# EAGLE design working (EAGLE 5.11)
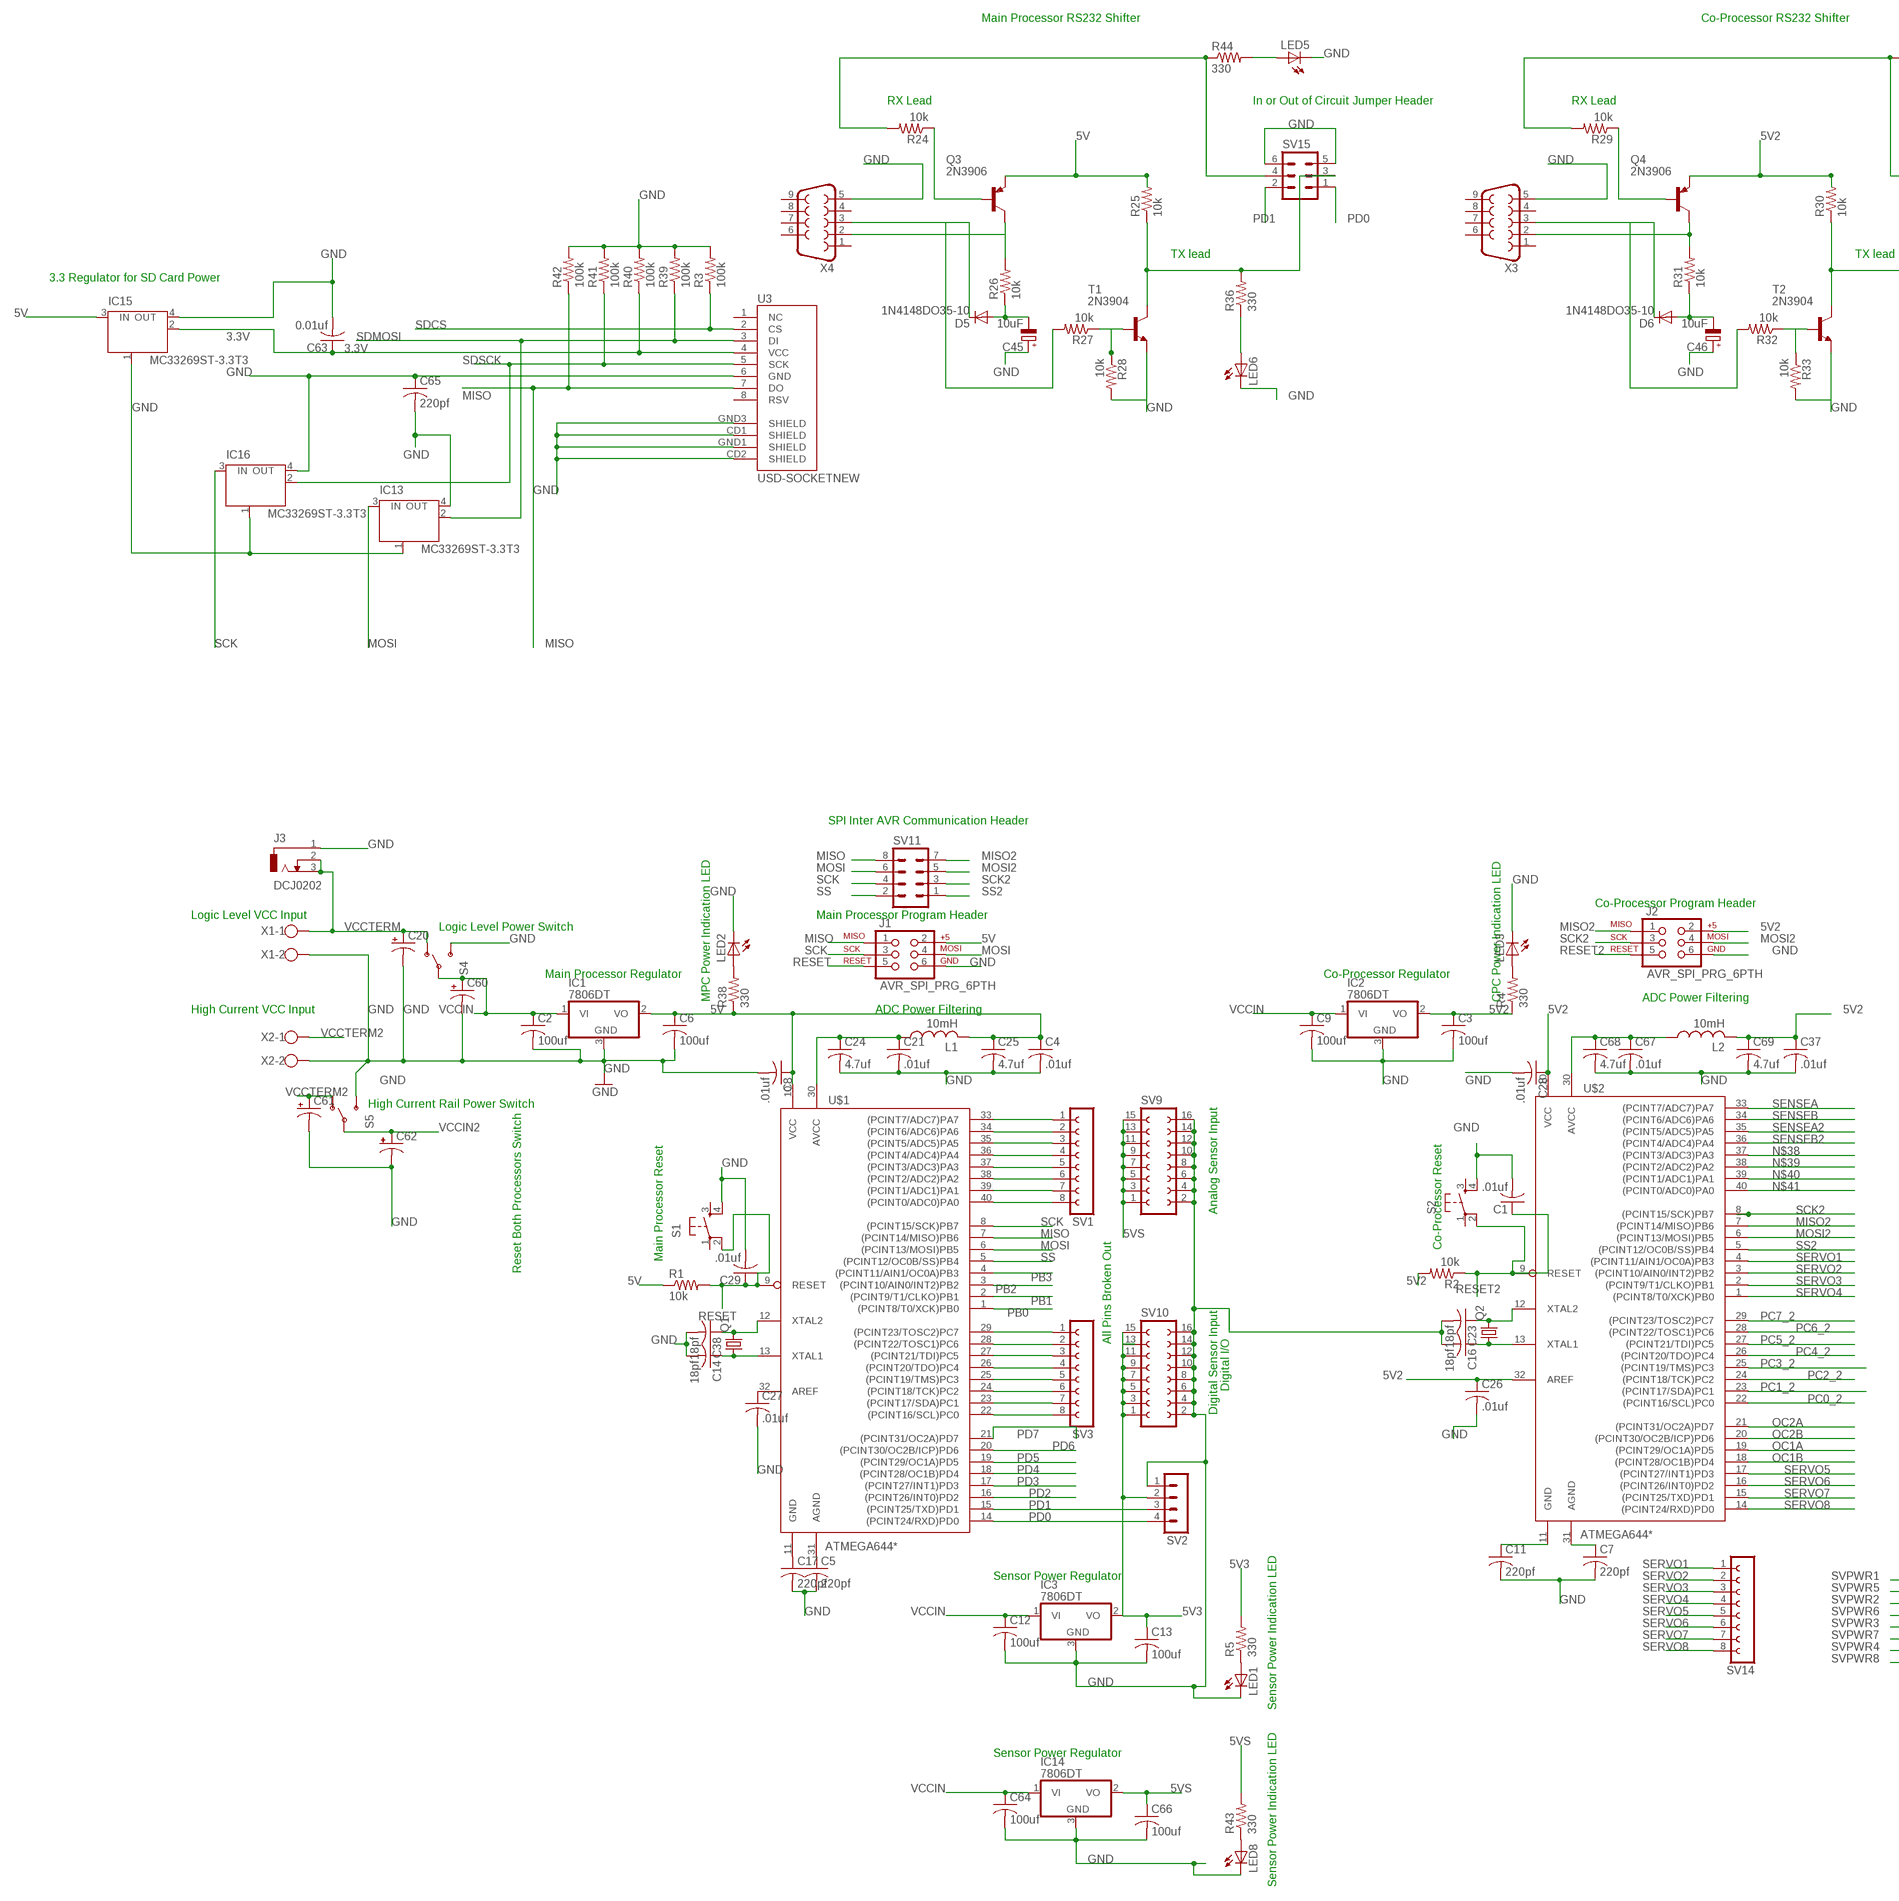
[diagram p0: schematic, sheet 1, part 1 of 2]
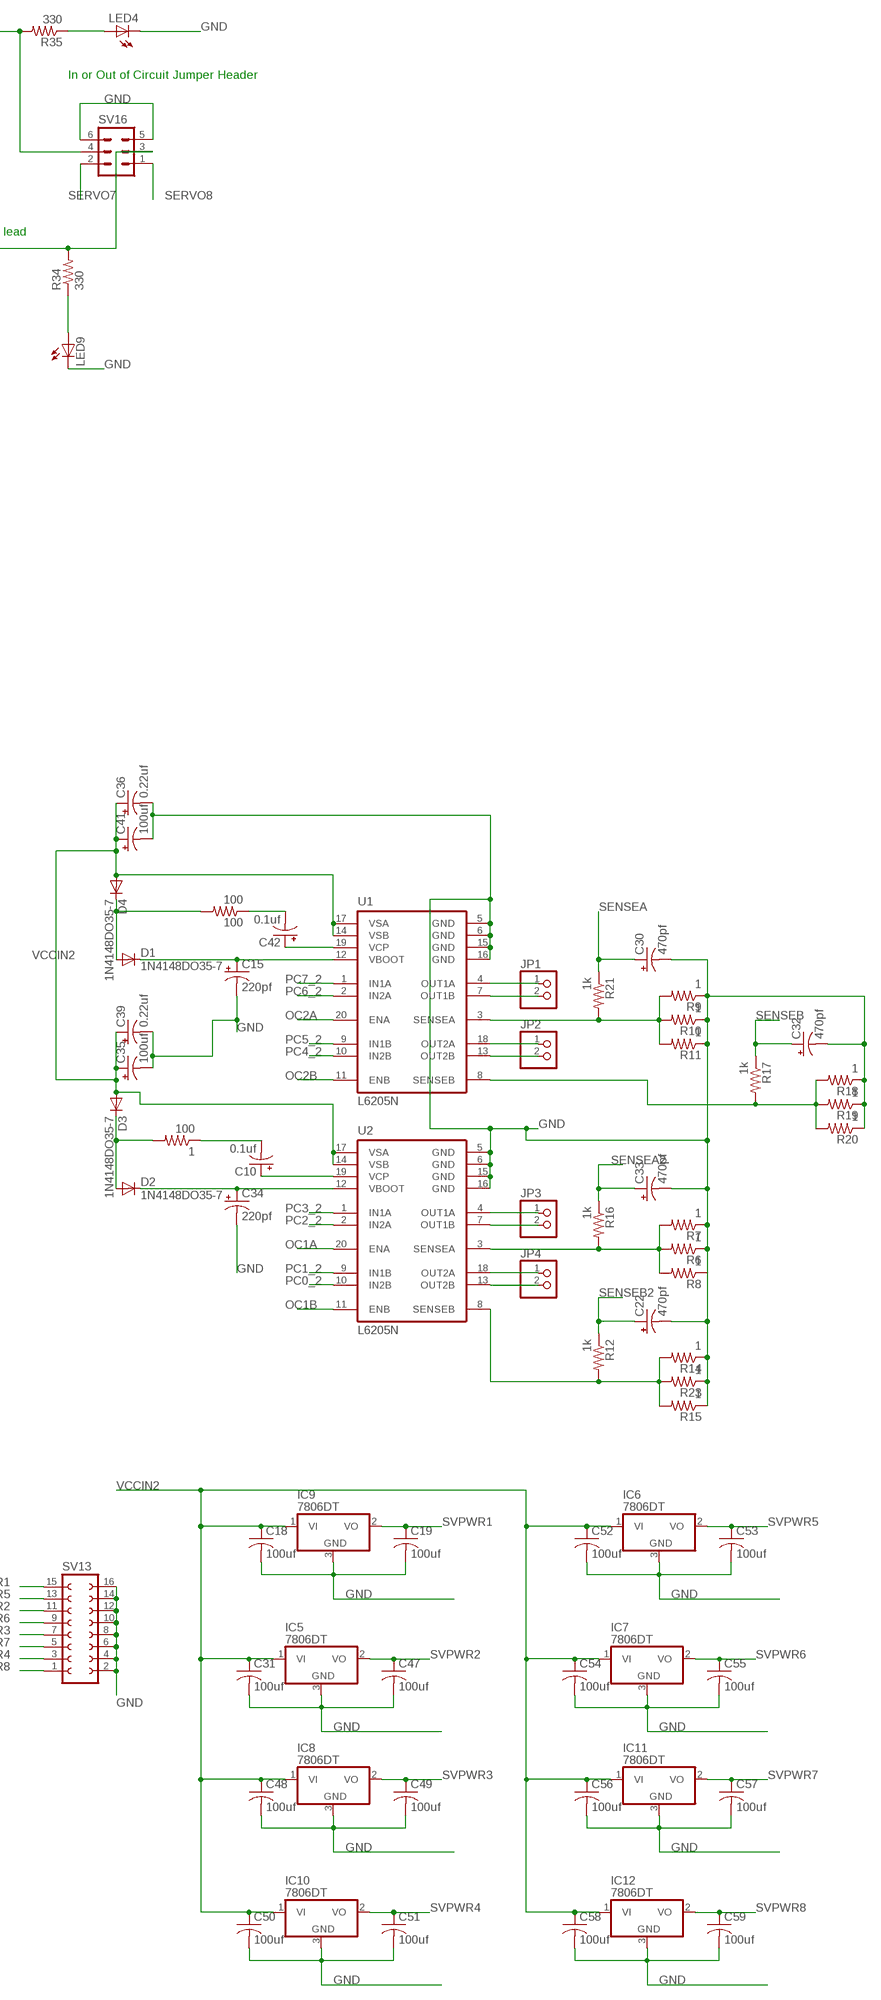
[diagram p1: schematic, sheet 1, part 2 of 2]

## Parts
1  100  R-US_0204/5  [0204/5]
100  100  R-US_0204/5  [0204/5]
C1  .01uf  C-USC1310  [C1310]
C2  100uf  C-USC1206K  [C1206K]
C3  100uf  C-USC1206K  [C1206K]
C4  .01uf  C-USC1310  [C1310]
C5  220pf  C-USC1206K  [C1206K]
C6  100uf  C-USC1206K  [C1206K]
C7  220pf  C-USC1206K  [C1206K]
C8  .01uf  C-USC1310  [C1310]
C9  100uf  C-USC1206K  [C1206K]
C10  0.1uf  CPOL-USE1.8-4  [E1,8-4]
C11  220pf  C-USC1206K  [C1206K]
C12  100uf  C-USC1206K  [C1206K]
C13  100uf  C-USC1206K  [C1206K]
C14  18pf  C-USC1206K  [C1206K]
C15  220pf  CPOL-USE1.8-4  [E1,8-4]
C16  18pf  C-USC1206K  [C1206K]
C17  220pf  C-USC1206K  [C1206K]
C18  100uf  C-USC1206K  [C1206K]
C19  100uf  C-USC1206K  [C1206K]
C20  CPOL-USE1.8-4  [E1,8-4]
C21  .01uf  C-USC1310  [C1310]
C22  470pf  CPOL-USE1.8-4  [E1,8-4]
C23  18pf  C-USC1206K  [C1206K]
C24  4.7uf  C-USC1310  [C1310]
C25  4.7uf  C-USC1310  [C1310]
C26  .01uf  C-USC1310  [C1310]
C27  .01uf  C-USC1310  [C1310]
C28  .01uf  C-USC1310  [C1310]
C29  .01uf  C-USC1310  [C1310]
C30  470pf  CPOL-USE1.8-4  [E1,8-4]
C31  100uf  C-USC1206K  [C1206K]
C32  470pf  CPOL-USE1.8-4  [E1,8-4]
C33  470pf  CPOL-USE1.8-4  [E1,8-4]
C34  220pf  CPOL-USE1.8-4  [E1,8-4]
C35  100uf  CPOL-USE1.8-4  [E1,8-4]
C36  0.22uf  CPOL-USE1.8-4  [E1,8-4]
C37  .01uf  C-USC1310  [C1310]
C38  18pf  C-USC1206K  [C1206K]
C39  0.22uf  CPOL-USE1.8-4  [E1,8-4]
C41  100uf  CPOL-USE1.8-4  [E1,8-4]
C42  0.1uf  CPOL-USE1.8-4  [E1,8-4]
C45  10uF  CPOL-EUE1.8-4  [E1,8-4]
C46  10uF  CPOL-EUE1.8-4  [E1,8-4]
C47  100uf  C-USC1206K  [C1206K]
C48  100uf  C-USC1206K  [C1206K]
C49  100uf  C-USC1206K  [C1206K]
C50  100uf  C-USC1206K  [C1206K]
C51  100uf  C-USC1206K  [C1206K]
C52  100uf  C-USC1206K  [C1206K]
C53  100uf  C-USC1206K  [C1206K]
C54  100uf  C-USC1206K  [C1206K]
C55  100uf  C-USC1206K  [C1206K]
C56  100uf  C-USC1206K  [C1206K]
C57  100uf  C-USC1206K  [C1206K]
C58  100uf  C-USC1206K  [C1206K]
C59  100uf  C-USC1206K  [C1206K]
C60  CPOL-USE1.8-4  [E1,8-4]
C61  CPOL-USE1.8-4  [E1,8-4]
C62  CPOL-USE1.8-4  [E1,8-4]
C63  0.01uf  C-USC1206K  [C1206K]
C64  100uf  C-USC1206K  [C1206K]
C65  220pf  C-USC1206K  [C1206K]
C66  100uf  C-USC1206K  [C1206K]
C67  .01uf  C-USC1310  [C1310]
C68  4.7uf  C-USC1310  [C1310]
C69  4.7uf  C-USC1310  [C1310]
D1  1N4148DO35-7  [DO35-7]
D2  1N4148DO35-7  [DO35-7]
D3  1N4148DO35-7  [DO35-7]
D4  1N4148DO35-7  [DO35-7]
D5  1N4148DO35-10  [DO35-10]
D6  1N4148DO35-10  [DO35-10]
IC1  7806DT  [TO252]
IC2  7806DT  [TO252]
IC3  7806DT  [TO252]
IC5  7806DT  [TO252]
IC6  7806DT  [TO252]
IC7  7806DT  [TO252]
IC8  7806DT  [TO252]
IC9  7806DT  [TO252]
IC10  7806DT  [TO252]
IC11  7806DT  [TO252]
IC12  7806DT  [TO252]
IC13  MC33269ST-3.3T3  [SOT223]
IC14  7806DT  [TO252]
IC15  MC33269ST-3.3T3  [SOT223]
IC16  MC33269ST-3.3T3  [SOT223]
J1  AVR_SPI_PRG_6PTH  [2X3]
J2  AVR_SPI_PRG_6PTH  [2X3]
J3  DCJ0202  [DCJ0202]
JP1  PINHD-1X2  [1X02]
JP2  PINHD-1X2  [1X02]
JP3  PINHD-1X2  [1X02]
JP4  PINHD-1X2  [1X02]
L1  10mH  L-USL3230M  [L3230M]
L2  10mH  L-USL3230M  [L3230M]
LED1  LED3MM  [LED3MM]
LED2  LED3MM  [LED3MM]
LED3  LED3MM  [LED3MM]
LED4  LED3MM  [LED3MM]
LED5  LED3MM  [LED3MM]
LED6  LED3MM  [LED3MM]
LED8  LED3MM  [LED3MM]
LED9  LED3MM  [LED3MM]
Q1  CRYSTALTC38H  [TC38H]
Q2  CRYSTALTC38H  [TC38H]
Q3  2N3906  [TO92]
Q4  2N3906  [TO92]
R1  10k  R-US_M1206  [M1206]
R2  10k  R-US_M1206  [M1206]
R3  100k  R-US_M1206  [M1206]
R4  330  R-US_M1206  [M1206]
R5  330  R-US_M1206  [M1206]
R6  1  R-US_0204/5  [0204/5]
R7  1  R-US_0204/5  [0204/5]
R8  1  R-US_0204/5  [0204/5]
R9  1  R-US_0204/5  [0204/5]
R10  1  R-US_0204/5  [0204/5]
R11  1  R-US_0204/5  [0204/5]
R12  1k  R-US_0204/5  [0204/5]
R14  1  R-US_0204/5  [0204/5]
R15  1  R-US_0204/5  [0204/5]
R16  1k  R-US_0204/5  [0204/5]
R17  1k  R-US_0204/5  [0204/5]
R18  1  R-US_0204/5  [0204/5]
R19  1  R-US_0204/5  [0204/5]
R20  1  R-US_0204/5  [0204/5]
R21  1k  R-US_0204/5  [0204/5]
R23  1  R-US_0204/5  [0204/5]
R24  10k  R-US_0204/5  [0204/5]
R25  10k  R-US_0204/5  [0204/5]
R26  10k  R-US_0204/5  [0204/5]
R27  10k  R-US_0204/5  [0204/5]
R28  10k  R-US_0204/5  [0204/5]
R29  10k  R-US_0204/5  [0204/5]
R30  10k  R-US_0204/5  [0204/5]
R31  10k  R-US_0204/5  [0204/5]
R32  10k  R-US_0204/5  [0204/5]
R33  10k  R-US_0204/5  [0204/5]
R34  330  R-US_0204/5  [0204/5]
R35  330  R-US_0204/5  [0204/5]
R36  330  R-US_0204/5  [0204/5]
R38  330  R-US_M1206  [M1206]
R39  100k  R-US_M1206  [M1206]
R40  100k  R-US_M1206  [M1206]
R41  100k  R-US_M1206  [M1206]
R42  100k  R-US_M1206  [M1206]
R43  330  R-US_M1206  [M1206]
R44  330  R-US_0204/5  [0204/5]
S1  TAC_SWITCHPTH  [TACTILE-PTH]
S2  TAC_SWITCHPTH  [TACTILE-PTH]
S4  SWITCH-SPSTPTH  [SWITCH-SPDT]
S5  SWITCH-SPSTPTH  [SWITCH-SPDT]
SV1  FE08-1  [FE08]
SV2  MA04-1  [MA04-1]
SV3  FE08-1  [FE08]
SV9  FE08-2  [FE08-2]
SV10  FE08-2  [FE08-2]
SV11  MA04-2  [MA04-2]
SV13  FE08-2  [FE08-2]
SV14  FE08-1  [FE08]
SV15  MA03-2  [MA03-2]
SV16  MA03-2  [MA03-2]
T1  2N3904  [TO92]
T2  2N3904  [TO92]
U1  L6205N  [DIL20]
U2  L6205N  [DIL20]
U3  USD-SOCKETNEW  [MICRO-SD-SOCKET-PP]
U$1  ATMEGA644*  [ATMEGA644]
U$2  ATMEGA644*  [ATMEGA644]
X1  W237-102  [W237-102]
X2  W237-102  [W237-102]
X3  DB9FEMALE  [DB9]
X4  DB9FEMALE  [DB9]

## Nets
3.3V: C63.1 IC15.2(OUT) R40.1 U3.4(VCC)
5V: C4.1 C6.1 C8.1 C25.1 C27.1 IC1.2(VO) IC15.3(IN) J1.2 L1.2 Q3.3(E) R1.1 R25.2 R38.1 U$1.10(VCC) U$1.32(AREF)
5V2: C3.1 C26.1 C28.1 C37.1 C69.1 IC2.2(VO) J2.2 L2.2 Q4.3(E) R2.2 R4.1 R30.2 U$2.10(VCC) U$2.32(AREF)
5V3: C13.1 IC3.2(VO) R5.2 SV2.2 SV10.1 SV10.3 SV10.5 SV10.7 SV10.9 SV10.11 SV10.13
5VS: C66.1 IC14.2(VO) R43.2 SV9.1 SV9.3 SV9.5 SV9.7 SV9.9 SV9.11 SV9.13 SV9.15
GND: C1.2 C2.2 C3.2 C4.2 C5.2 C6.2 C7.2 C8.2 C9.2 C11.2 C12.2 C13.2 C14.2 C15.- C16.2 C17.2 C18.2 C19.2 C20.- C21.2 C22.- C23.2 C24.2 C25.2 C26.2 C27.2 C28.2 C29.2 C30.- C31.2 C32.- C33.- C34.- C35.- C36.- C37.2 C38.2 C39.- C41.- C45.+ C46.+ C47.2 C48.2 C49.2 C50.2 C51.2 C52.2 C53.2 C54.2 C55.2 C56.2 C57.2 C58.2 C59.2 C60.- C61.- C62.- C63.2 C64.2 C65.1 C65.2 C66.2 C67.2 C68.2 C69.2 IC1.3(GND) IC2.3(GND) IC3.3(GND) IC5.3(GND) IC6.3(GND) IC7.3(GND) IC8.3(GND) IC9.3(GND) IC10.3(GND) IC11.3(GND) IC12.3(GND) IC13.1(GND/ADJ) IC13.4(OUT) IC14.3(GND) IC15.1(GND/ADJ) IC15.4(OUT) IC16.1(GND/ADJ) IC16.4(OUT) J1.6 J2.6 J3.1 LED1.K(C) LED2.K(C) LED3.K(C) LED4.K(C) LED5.K(C) LED6.K(C) LED8.K(C) LED9.K(C) R3.2 R6.1 R7.1 R8.1 R9.1 R10.1 R11.1 R14.1 R15.1 R18.1 R19.1 R20.1 R23.1 R28.2 R33.2 R39.2 R40.2 R41.2 R42.2 S1.4 S2.4 S4.3(S) S5.3(S) SV2.1 SV9.2 SV9.4 SV9.6 SV9.8 SV9.10 SV9.12 SV9.14 SV9.16 SV10.2 SV10.4 SV10.6 SV10.8 SV10.10 SV10.12 SV10.14 SV10.16 SV13.2 SV13.4 SV13.6 SV13.8 SV13.10 SV13.12 SV13.14 SV13.16 SV15.5 SV15.6 SV16.5 SV16.6 T1.3(E) T2.3(E) U1.5(GND) U1.6(GND) U1.15(GND) U1.16(GND) U2.5(GND) U2.6(GND) U2.15(GND) U2.16(GND) U3.6(GND) U3.CD1(SHIELD) U3.CD2(SHIELD) U3.GND1(SHIELD) U3.GND3(SHIELD) X1.2 X2.2 X3.5 X4.5
MISO: J1.1 R42.1 SV11.8 U3.7(DO) U$1.7((PCINT14/MISO)PB6)
MISO2: J2.1 SV11.7 U$2.7((PCINT14/MISO)PB6)
MOSI: IC13.3(IN) J1.4 SV11.6 U$1.6((PCINT13/MOSI)PB5)
MOSI2: J2.4 SV11.5 U$2.6((PCINT13/MOSI)PB5)
N$1: LED1.A R5.1
N$2: LED2.A R38.2
N$3: LED3.A R4.2
N$4: C21.1 C24.1 L1.1 U$1.30(AVCC)
N$5: C5.1 U$1.31(AGND)
N$6: JP1.1 U1.4(OUT1A)
N$7: SV1.1 U$1.33((PCINT7/ADC7)PA7)
N$8: SV1.2 U$1.34((PCINT6/ADC6)PA6)
N$9: SV1.3 U$1.35((PCINT5/ADC5)PA5)
N$10: SV1.4 U$1.36((PCINT4/ADC4)PA4)
N$11: SV1.5 U$1.37((PCINT3/ADC3)PA3)
N$12: SV1.6 U$1.38((PCINT2/ADC2)PA2)
N$13: SV1.7 U$1.39((PCINT1/ADC1)PA1)
N$14: SV1.8 U$1.40((PCINT0/ADC0)PA0)
N$15: SV3.1 U$1.29((PCINT23/TOSC2)PC7)
N$16: SV3.2 U$1.28((PCINT22/TOSC1)PC6)
N$17: SV3.3 U$1.27((PCINT21/TDI)PC5)
N$18: SV3.4 U$1.26((PCINT20/TDO)PC4)
N$19: SV3.5 U$1.25((PCINT19/TMS)PC3)
N$20: SV3.6 U$1.24((PCINT18/TCK)PC2)
N$21: SV3.7 U$1.23((PCINT17/SDA)PC1)
N$22: SV3.8 U$1.22((PCINT16/SCL)PC0)
N$23: JP1.2 U1.7(OUT1B)
N$24: JP2.1 U1.18(OUT2A)
N$25: JP2.2 U1.13(OUT2B)
N$26: JP3.1 U2.4(OUT1A)
N$27: JP3.2 U2.7(OUT1B)
N$28: JP4.1 U2.18(OUT2A)
N$29: JP4.2 U2.13(OUT2B)
N$30: C15.+ D1.C U1.12(VBOOT)
N$31: C34.+ D2.C U2.12(VBOOT)
N$32: R6.2 R7.2 R8.2 R16.2 U2.3(SENSEA)
N$33: C14.1 Q1.1 U$1.13(XTAL1)
N$34: C38.1 Q1.2 U$1.12(XTAL2)
N$35: C16.1 Q2.1 U$2.13(XTAL1)
N$36: C23.1 Q2.2 U$2.12(XTAL2)
N$37: C42.+ U1.19(VCP)
N$38: U$2.37((PCINT3/ADC3)PA3)
N$39: U$2.38((PCINT2/ADC2)PA2)
N$40: U$2.39((PCINT1/ADC1)PA1)
N$41: U$2.40((PCINT0/ADC0)PA0)
N$42: R9.2 R10.2 R11.2 R21.2 U1.3(SENSEA)
N$43: C10.+ U2.19(VCP)
N$44: R12.2 R14.2 R15.2 R23.2 U2.8(SENSEB)
N$45: 100.1 C42.-
N$46: R17.2 R18.2 R19.2 R20.2 U1.8(SENSEB)
N$47: 1.1 C10.-
N$48: 1.2 D2.A D3.C
N$49: 100.2 D1.A D4.C
N$50: Q4.1(C) R31.2 X3.2
N$51: Q4.2(B) R29.1
N$52: Q3.1(C) R26.2 X4.2
N$53: Q3.2(B) R24.1
N$54: R25.1 R36.2 SV15.3 T1.1(C)
N$55: R27.1 R28.1 T1.2(B)
N$56: D5.C R27.2 X4.3
N$57: C45.- D5.A R26.1
N$58: R30.1 R34.2 SV16.3 T2.1(C)
N$59: R32.1 R33.1 T2.2(B)
N$60: D6.C R32.2 X3.3
N$61: C46.- D6.A R31.1
N$62: R29.2 R35.2 SV16.4
N$63: LED9.A R34.1
N$64: LED4.A R35.1
N$65: LED5.A R44.2
N$66: LED6.A R36.1
N$67: C11.1 U$2.11(GND)
N$68: C17.1 U$1.11(GND)
N$69: LED8.A R43.1
N$70: SV10.15
N$71: C67.1 C68.1 L2.1 U$2.30(AVCC)
N$72: C7.1 U$2.31(AGND)
N$74: R24.2 R44.1 SV15.4
OC1A: U2.20(ENA) U$2.19((PCINT29/OC1A)PD5)
OC1B: U2.11(ENB) U$2.18((PCINT28/OC1B)PD4)
OC2A: U1.20(ENA) U$2.21((PCINT31/OC2A)PD7)
OC2B: U1.11(ENB) U$2.20((PCINT30/OC2B/ICP)PD6)
PB0: U$1.1((PCINT8/T0/XCK)PB0)
PB1: U$1.2((PCINT9/T1/CLKO)PB1)
PB2: U$1.3((PCINT10/AIN0/INT2)PB2)
PB3: U$1.4((PCINT11/AIN1/OC0A)PB3)
PC0_2: U2.10(IN2B) U$2.22((PCINT16/SCL)PC0)
PC1_2: U2.9(IN1B) U$2.23((PCINT17/SDA)PC1)
PC2_2: U2.2(IN2A) U$2.24((PCINT18/TCK)PC2)
PC3_2: U2.1(IN1A) U$2.25((PCINT19/TMS)PC3)
PC4_2: U1.10(IN2B) U$2.26((PCINT20/TDO)PC4)
PC5_2: U1.9(IN1B) U$2.27((PCINT21/TDI)PC5)
PC6_2: U1.2(IN2A) U$2.28((PCINT22/TOSC1)PC6)
PC7_2: U1.1(IN1A) U$2.29((PCINT23/TOSC2)PC7)
PD0: SV2.4 SV15.1 U$1.14((PCINT24/RXD)PD0)
PD1: SV2.3 SV15.2 U$1.15((PCINT25/TXD)PD1)
PD2: U$1.16((PCINT26/INT0)PD2)
PD3: U$1.17((PCINT27/INT1)PD3)
PD4: U$1.18((PCINT28/OC1B)PD4)
PD5: U$1.19((PCINT29/OC1A)PD5)
PD6: U$1.20((PCINT30/OC2B/ICP)PD6)
PD7: U$1.21((PCINT31/OC2A)PD7)
RESET: C29.1 J1.5 R1.2 S1.2 U$1.9(RESET)
RESET2: C1.1 J2.5 R2.1 S2.2 U$2.9(RESET)
SCK: IC16.3(IN) J1.3 SV11.4 U$1.8((PCINT15/SCK)PB7)
SCK2: J2.3 SV11.3 U$2.8((PCINT15/SCK)PB7)
SDCS: R3.1 U3.2(CS)
SDMOSI: IC13.2(OUT) R39.1 U3.3(DI)
SDSCK: IC16.2(OUT) R41.1 U3.5(SCK)
SENSEA: C30.+ R21.1 U$2.33((PCINT7/ADC7)PA7)
SENSEA2: C33.+ R16.1 U$2.35((PCINT5/ADC5)PA5)
SENSEB: C32.+ R17.1 U$2.34((PCINT6/ADC6)PA6)
SENSEB2: C22.+ R12.1 U$2.36((PCINT4/ADC4)PA4)
SERVO1: SV14.1 U$2.4((PCINT11/AIN1/OC0A)PB3)
SERVO2: SV14.2 U$2.3((PCINT10/AIN0/INT2)PB2)
SERVO3: SV14.3 U$2.2((PCINT9/T1/CLKO)PB1)
SERVO4: SV14.4 U$2.1((PCINT8/T0/XCK)PB0)
SERVO5: SV14.5 U$2.17((PCINT27/INT1)PD3)
SERVO6: SV14.6 U$2.16((PCINT26/INT0)PD2)
SERVO7: SV14.7 SV16.2 U$2.15((PCINT25/TXD)PD1)
SERVO8: SV14.8 SV16.1 U$2.14((PCINT24/RXD)PD0)
SS: SV11.2 U$1.5((PCINT12/OC0B/SS)PB4)
SS2: SV11.1 U$2.5((PCINT12/OC0B/SS)PB4)
SVPWR1: C19.1 IC9.2(VO) SV13.15
SVPWR2: C47.1 IC5.2(VO) SV13.11
SVPWR3: C49.1 IC8.2(VO) SV13.7
SVPWR4: C51.1 IC10.2(VO) SV13.3
SVPWR5: C53.1 IC6.2(VO) SV13.13
SVPWR6: C55.1 IC7.2(VO) SV13.9
SVPWR7: C57.1 IC11.2(VO) SV13.5
SVPWR8: C59.1 IC12.2(VO) SV13.1
VCCIN: C2.1 C9.1 C12.1 C60.+ C64.1 IC1.1(VI) IC2.1(VI) IC3.1(VI) IC14.1(VI) S4.2(P)
VCCIN2: C18.1 C31.1 C35.+ C36.+ C39.+ C41.+ C48.1 C50.1 C52.1 C54.1 C56.1 C58.1 C62.+ D3.A D4.A IC5.1(VI) IC6.1(VI) IC7.1(VI) IC8.1(VI) IC9.1(VI) IC10.1(VI) IC11.1(VI) IC12.1(VI) S5.2(P) U1.14(VSB) U1.17(VSA) U2.14(VSB) U2.17(VSA)
VCCTERM: C20.+ J3.2 J3.3 S4.1(O) X1.1
VCCTERM2: C61.+ S5.1(O) X2.1
Unconnected: S1.1 S1.3 S2.1 S2.3 U3.1(NC) U3.8(RSV) X3.1 X3.4 X3.6 X3.7 X3.8 X3.9 X4.1 X4.4 X4.6 X4.7 X4.8 X4.9

## Notes on the sheet
- Main Processor RS232 Shifter | Co-Processor RS232 Shifter
- RX Lead | In or Out of Circuit Jumper Header | RX Lead | In or Out of Circuit Jumper Header
- TX lead | TX lead
- 3.3 Regulator for SD Card Power
- SPI Inter AVR Communication Header
- Co-Processor Program Header
- Logic Level VCC Input | Main Processor Program Header
- Logic Level Power Switch
- Main Processor Regulator | Co-Processor Regulator
- MPC Power Indication LED | CPC Power Indication LED | ADC Power Filtering
- High Current VCC Input | ADC Power Filtering
- High Current Rail Power Switch
- Analog Sensor Input
- Co-Processor Reset
- Main Processor Reset
- Reset Both Processors Switch
- All Pins Broken Out
- Digital I/O
- Digital Sensor Input
- Sensor Power Regulator
- Sensor Power Indication LED
- Sensor Power Regulator
- Sensor Power Indication LED

## Library data of the parts
1 100 R1 R2 R6-R12 R14-R21 R23-R36 R44 = resistor:R-US_: RESISTOR, American symbol
C1 C4 C8 C21 C24-C29 C37 C67-C69 = rcl:C-US: CAPACITOR, American symbol
C2 C3 C5-C7 C9 C11-C14 C16-C19 C23 C31 C38 C47-C59 C63-C66 = resistor:C-US: CAPACITOR, American symbol
C10 C15 C20 C22 C30 C32-C36 C39 C41 C42 C60-C62 = rcl:CPOL-US: POLARIZED CAPACITOR, American symbol
C45 C46 = rcl:CPOL-EU: POLARIZED CAPACITOR, European symbol
D1-D6 = diode:1N4148: DIODE high speed (Philips)
IC1-IC3 IC5-IC12 IC14 = linear:78*: Positive VOLTAGE REGULATOR Source: http://cache.national.com/ds/LM/LM78L05.pdf http://www.fairchildsemi.com/ds/LM/LM7805.pdf
IC13 IC15 IC16 = linear:MC33269ST*: Adjustable Output Low Dropout Voltage Regulator 800 mA Source: http://www.onsemi.com/pub/Collateral/MC33269-D.PDF
J1 J2 = SparkFun:AVR_SPI_PRG_6: AVR ISP 6 Pin This is the reduced ISP connector for AVR programming. Common on Arduino. This footprint will take up less PCB space and can be used with a 10-pin to 6-pin adapter such as SKU: BOB-08508
J3 = con-jack:DCJ0202: DC POWER JACK Source: DCJ0202.pdf; OC_FARNELL: unknown; OC_NEWARK: unknown
JP1-JP4 = pinhead:PINHD-1X2: PIN HEADER
L1 L2 = rcl:L-US: INDUCTOR, American symbol
LED1-LED6 LED8 LED9 = led:LED: LED OSRAM: - CHIPLED LG R971, LG N971, LY N971, LG Q971, LY Q971, LO R971, LY R971 LH N974, LH R974 LS Q976, LO Q976, LY Q976 LO Q996 - Hyper CHIPLED LW Q18S LB Q993, LB Q99A, LB R99A - SideLED LS A670, LO A670, LY A670, LG A670, LP A670 LB A673, LV A673, LT A673, LW A673 LH A674 LY A675 LS A676, LA A676, LO A676, LY A676, LW A676 LS A679, LY A679, LG A679 - Hyper Micro SIDELED® LS Y876, LA Y876, LO Y876, LY Y876 LT Y87S - SmartLED LW L88C, LW L88S LB L89C, LB L89S, LG L890 LS L89K, LO L89K, LY L89K LS L896, LA L896, LO L896, LY L896 - TOPLED LS T670, LO T670, LY T670, LG T670, LP T670 LSG T670, LSP T670, LSY T670, LOP T670, LYG T670 LG T671, LOG T671, LSG T671 LB T673, LV T673, LT T673, LW T673 LH T674 LS T676, LA T676, LO T676, LY T676, LB T676, LH T676, LSB T676, LW T676 LB T67C, LV T67C, LT T67C, LS T67K, LO T67K, LY T67K, LW E67C LS E67B, LA E67B, LO E67B, LY E67B, LB E67C, LV E67C, LT E67C LW T67C LS T679, LY T679, LG T679 LS T770, LO T770, LY T770, LG T770, LP T770 LB T773, LV T773, LT T773, LW T773 LH T774 LS E675, LA E675, LY E675, LS T675 LS T776, LA T776, LO T776, LY T776, LB T776 LHGB T686 LT T68C, LB T68C - Hyper Mini TOPLED® LB M676 - Mini TOPLED Santana® LG M470 LS M47K, LO M47K, LY M47K Source: http://www.osram.convergy.de LUXEON: - LUMILED® LXK2-PW12-R00, LXK2-PW12-S00, LXK2-PW14-U00, LXK2-PW14-V00 LXK2-PM12-R00, LXK2-PM12-S00, LXK2-PM14-U00 LXK2-PE12-Q00, LXK2-PE12-R00, LXK2-PE12-S00, LXK2-PE14-T00, LXK2-PE14-U00 LXK2-PB12-K00, LXK2-PB12-L00, LXK2-PB12-M00, LXK2-PB14-N00, LXK2-PB14-P00, LXK2-PB14-Q00 LXK2-PR12-L00, LXK2-PR12-M00, LXK2-PR14-Q00, LXK2-PR14-R00 LXK2-PD12-Q00, LXK2-PD12-R00, LXK2-PD12-S00 LXK2-PH12-R00, LXK2-PH12-S00 LXK2-PL12-P00, LXK2-PL12-Q00, LXK2-PL12-R00 Source: www.luxeon.com KINGBRIGHT: KA-3528ASYC Source: www.kingbright.com
Q1 Q2 = crystal:CRYSTAL: CRYSTAL; OC_FARNELL: unknown; OC_NEWARK: unknown
Q3 Q4 = transistor-pnp:2N3906: PNP Transistor
R3-R5 R38-R43 = rcl:R-US_: RESISTOR, American symbol
S1 S2 = SparkFun:TAC_SWITCH: Momentary Switch Button commonly used for reset or general input. Spark Fun Electronics SKU : COM-00097
S4 S5 = SparkFun:SWITCH-SPST: SPST Switch Simple slide switch. Spark Fun Electronics SKU : COM-00102
SV1 SV3 SV14 = con-lsta:FE08-1: FEMALE HEADER; OC_FARNELL: unknown; OC_NEWARK: unknown
SV2 = con-lstb:MA04-1: PIN HEADER; OC_FARNELL: unknown; OC_NEWARK: unknown
SV9 SV10 SV13 = con-lsta:FE08-2: FEMALE HEADER; OC_FARNELL: unknown; OC_NEWARK: unknown
SV11 = con-lstb:MA04-2: PIN HEADER; OC_FARNELL: unknown; OC_NEWARK: unknown
SV15 SV16 = con-lstb:MA03-2: PIN HEADER; OC_FARNELL: unknown; OC_NEWARK: unknown
T1 T2 = transistor:2N3904: NPN TRANSISTOR
U1 U2 = L6205:L6205*: L6205* DMOS DUAL FULL BRIDGE DRIVER Cases: L6205N (PowerDIP20), L6205D (PowerSO20) Author: Dipl.-Ing. FH Rainer Bayer, rainer.bayer@hs-heilbronn.de, www.ing-rb.de/hhn Notes: 1. ENA, ENB pin direction "I/O": see data sheet (ENA and ENB pins open collector driving vs. push-pull driving) 2. SENSEA, SENSEB pin direction "PWR": see data sheet (power ground)
U3 = SparkFun:USD-SOCKET: microSD Socket Push-push type uSD socket. Schematic element and footprint production proven. Spark Fun Electronics SKU : PRT-00127. tDoc lines correctly indicate media card edge positions when inserting (unlocked, locked, depressed).
U$1 U$2 = ATMega644:ATMEGA644
X1 X2 = con-wago-500:W237-102: WAGO SCREW CLAMP; MPN: 237-102; OC_FARNELL: unknown; OC_NEWARK: 70K9898
X3 X4 = SparkFun:DB9: DB9 Connector Standard DB9 (D-Sub 9) serial connector. Can be used for CAN bus as well as RS485 and RS232. Footprint production proven. Spark Fun Electronics SKU : PRT-00429

## Board
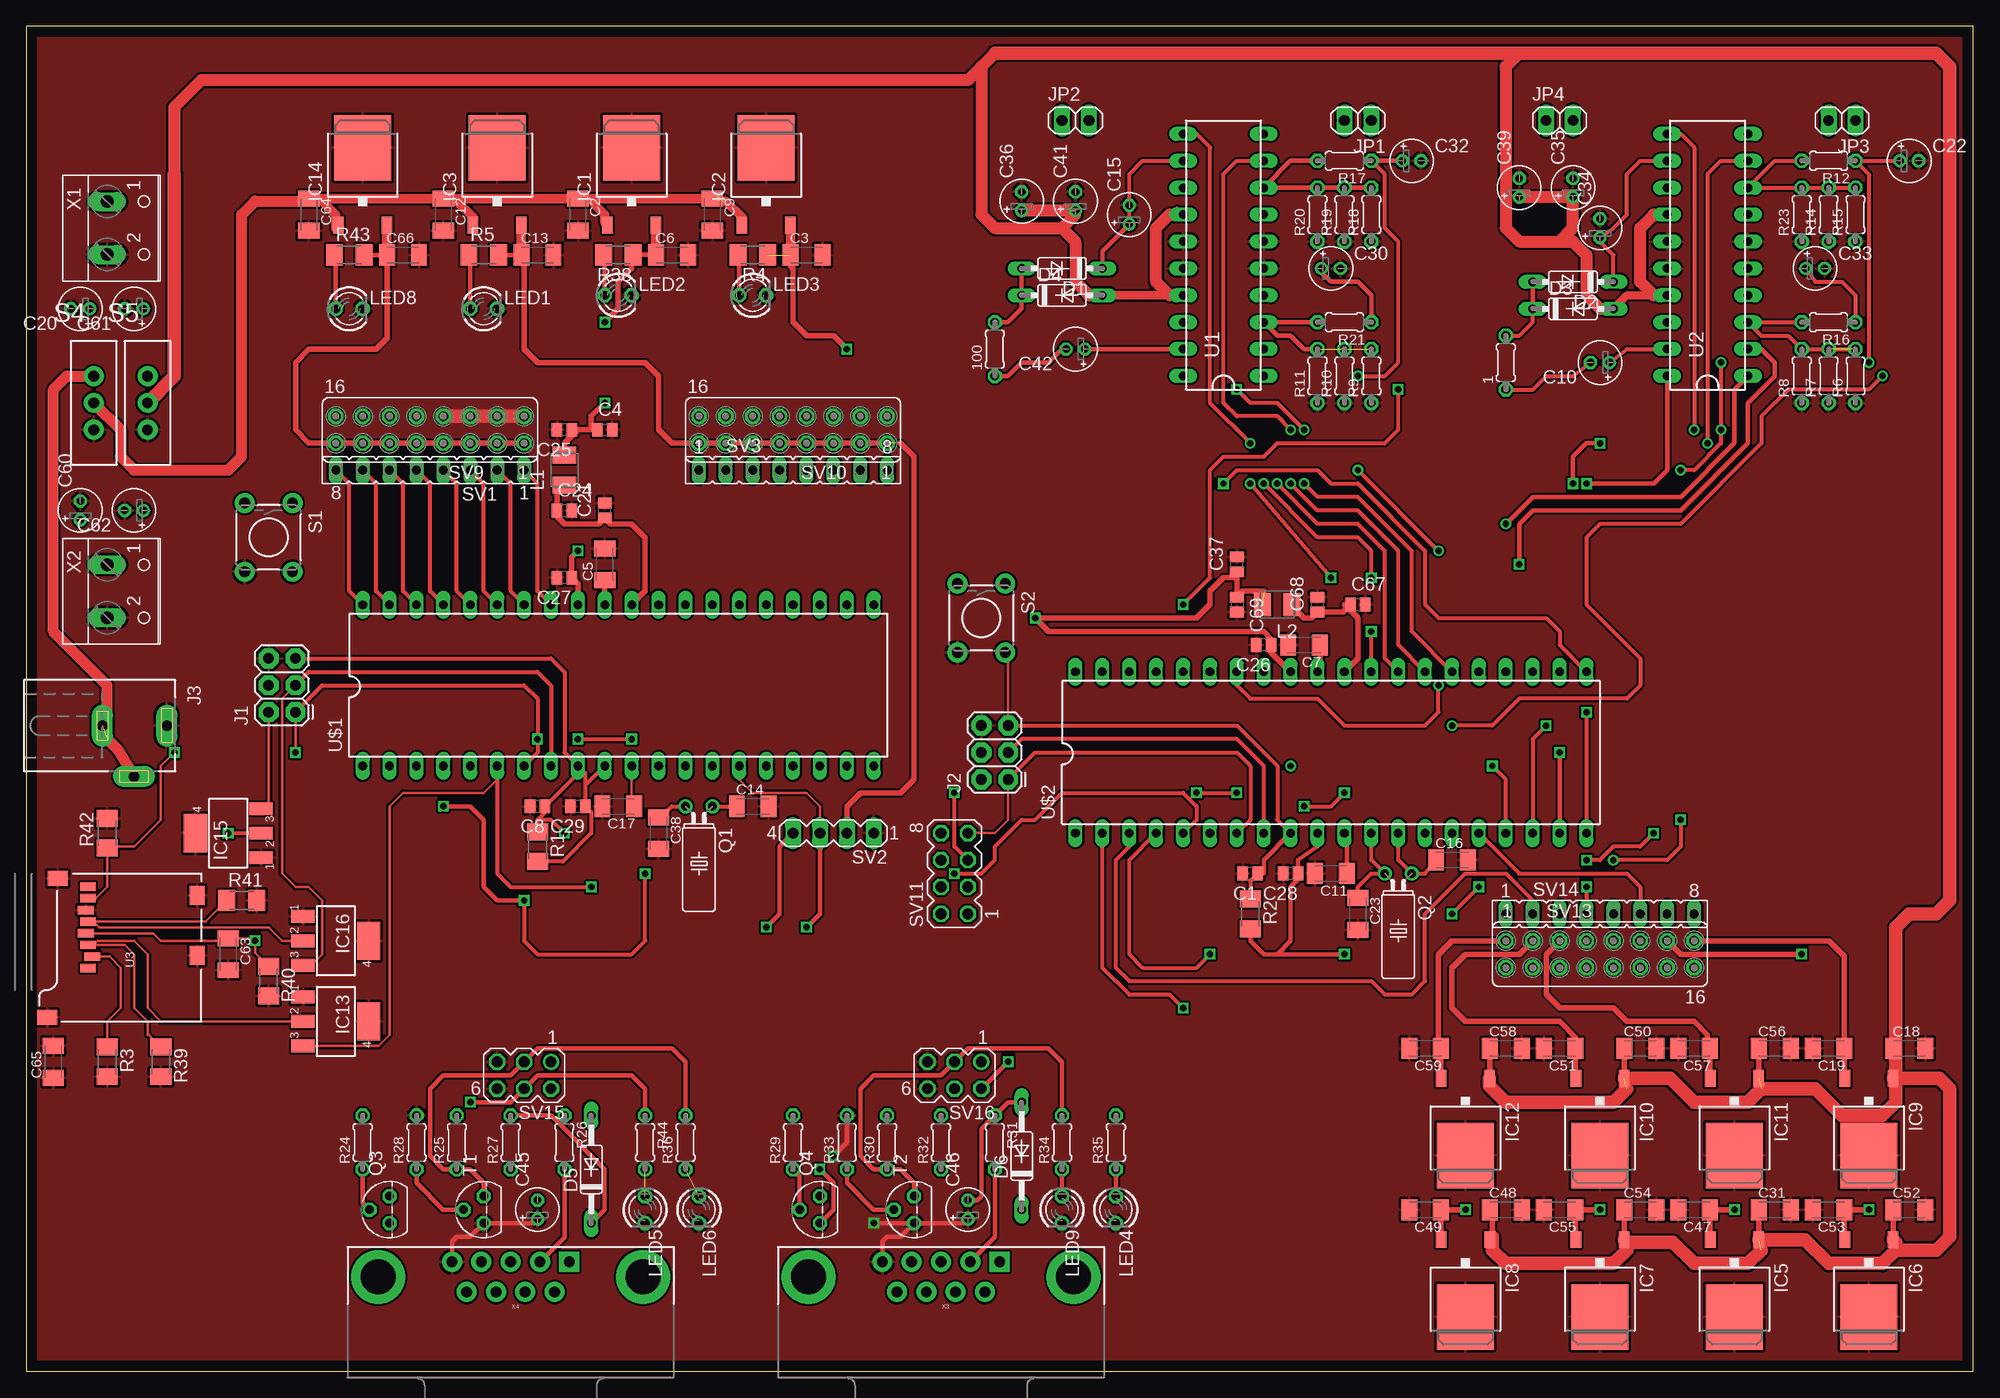
[diagram p2: board, top side]
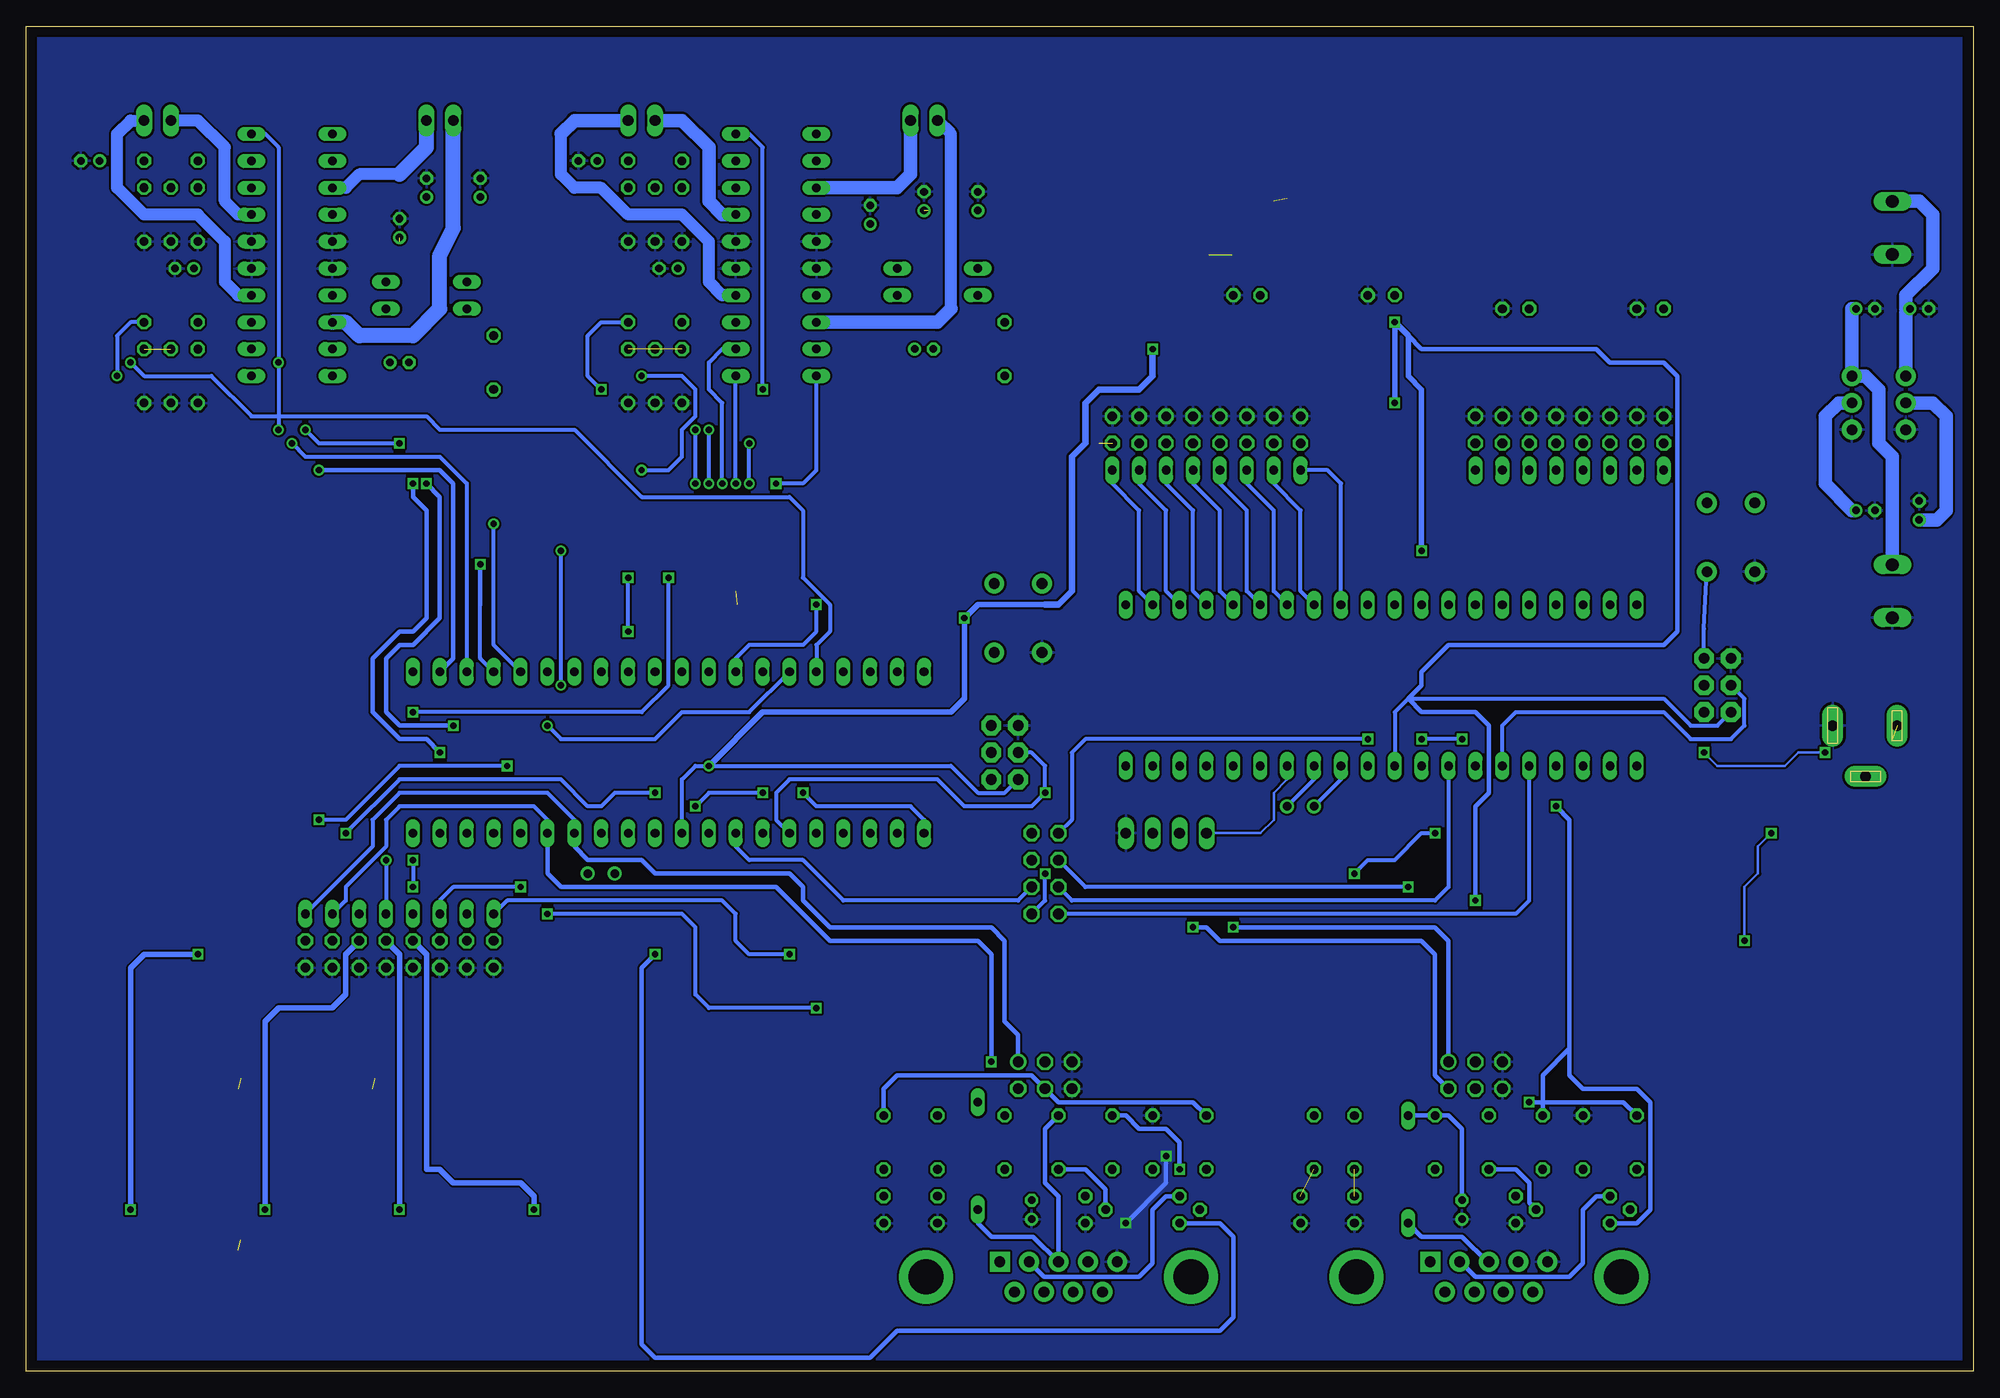
[diagram p3: board, bottom side, seen from below]

Size 183.82 x 126.99 mm. Coordinates in mm from the lower left corner, seen from the top.
Outline: 0,0 183.82,0 183.82,126.99 0,126.99 0,0
Copper layers (1*16): Top 0.035mm / dielectric 1.5mm / Bottom 0.035mm
Design rules "default": minimum track width 10mil, minimum drill 24mil, track to track 8mil, track to pad 8mil, pad to pad 8mil, via to via 8mil, smd to smd 8mil, copper to edge 40mil, drill to drill 8mil, minimum pad ring 10mil, minimum via ring 8mil, stop-mask expansion 4mil, vias tented up to drill 0mil, thermal gap 10mil

### Footprints (pad centres in the part's own frame; a part is rotated, then mirrored left to right if it is on the bottom)
0204/5 = drill 0.813 octagon: 1 -2.54,0; 2 2.54,0
C1310 = smd 1 x 1.3: 1 -0.7,0; 2 0.7,0
C1206K = smd 1.5 x 2: 1 -1.5,0; 2 1.5,0
E1,8-4 = drill 0.711 pad 1.168 round: + -0.889,0 | drill 0.711 pad 1.168 octagon: - 0.889,0
DO35-7 = drill 0.813 long: A 3.81,0; C -3.81,0
DO35-10 = drill 0.813 long: A 5.08,0; C -5.08,0
TO252 = smd 1 x 1.6: 1 -2.28,-4.8; 2 2.28,-4.8 | smd 5.4 x 6.2: 3 0,2.5
SOT223 = smd 1.219 x 2.235: 1 -2.311,-3.099; 2 0,-3.099; 3 2.311,-3.099 | smd 3.6 x 2.2: 4 0,3.099
2X3 = drill 1.016 pad 1.88 octagon: 1 0,0; 2 0,2.54; 3 2.54,0; 4 2.54,2.54; 5 5.08,0; 6 5.08,2.54
DCJ0202 = drill 1 pad 2 long: 1 0,3.1; 2 4.8,0; 3 0,-3
1X02 = drill 1.016 long: 1 -1.27,0; 2 1.27,0
L3230M = smd 1.6 x 2.2: 1 -1.4,0; 2 1.4,0
LED3MM = drill 0.813 octagon: A -1.27,0; K 1.27,0
TC38H = drill 0.813 round: 1 -1.27,0; 2 1.27,0
TO92 = drill 0.813 octagon: 1 1.27,0; 2 0,1.905; 3 -1.27,0
M1206 = smd 1.6 x 2: 1 -1.4,0; 2 1.4,0
TACTILE-PTH = drill 1.016 pad 1.88 round: 1 -3.251,2.261; 2 3.251,2.261; 3 -3.251,-2.261; 4 3.251,-2.261
SWITCH-SPDT = drill 1.016 pad 1.88 round: 1 0,2.54; 2 0,0; 3 0,-2.54
FE08 = drill 0.813 long: 1 -8.89,0; 2 -6.35,0; 3 -3.81,0; 4 -1.27,0; 5 1.27,0; 6 3.81,0; 7 6.35,0; 8 8.89,0
MA04-1 = drill 1.016 long: 1 -3.81,0; 2 -1.27,0; 3 1.27,0; 4 3.81,0
FE08-2 = drill 0.914 octagon: 1 -8.89,1.27; 2 -8.89,-1.27; 3 -6.35,1.27; 4 -6.35,-1.27; 5 -3.81,1.27; 6 -3.81,-1.27; 7 -1.27,1.27; 8 -1.27,-1.27; 9 1.27,1.27; 10 1.27,-1.27; 11 3.81,1.27; 12 3.81,-1.27; 13 6.35,1.27; 14 6.35,-1.27; 15 8.89,1.27; 16 8.89,-1.27
MA04-2 = drill 1.016 octagon: 1 -3.81,-1.27; 2 -3.81,1.27; 3 -1.27,-1.27; 4 -1.27,1.27; 5 1.27,-1.27; 6 1.27,1.27; 7 3.81,-1.27; 8 3.81,1.27
MA03-2 = drill 1.016 round: 1 -2.54,-1.27 | drill 1.016 octagon: 2 -2.54,1.27; 3 0,-1.27; 4 0,1.27; 5 2.54,-1.27; 6 2.54,1.27
DIL20 = drill 0.8 long: 1 -11.43,-3.81; 2 -8.89,-3.81; 3 -6.35,-3.81; 4 -3.81,-3.81; 5 -1.27,-3.81; 6 1.27,-3.81; 7 3.81,-3.81; 8 6.35,-3.81; 9 8.89,-3.81; 10 11.43,-3.81; 11 11.43,3.81; 12 8.89,3.81; 13 6.35,3.81; 14 3.81,3.81; 15 1.27,3.81; 16 -1.27,3.81; 17 -3.81,3.81; 18 -6.35,3.81; 19 -8.89,3.81; 20 -11.43,3.81
MICRO-SD-SOCKET-PP = smd 0.8 x 1.5: 1 -8.94,10.7; 2 -7.84,10.3; 3 -6.74,10.7; 4 -5.64,10.9; 5 -4.54,10.7; 6 -3.44,10.9; 7 -2.34,10.7; 8 -1.24,10.7 | smd 1.8 x 1.4: CD1 -2.05,0.4; CD2 -7.75,0.4 | smd 1.4 x 1.9: GND1 -13.6,14.55; GND3 -0.45,13.55
ATMEGA644 = drill 0.813 long: 1 -22.86,-7.62; 2 -20.32,-7.62; 3 -17.78,-7.62; 4 -15.24,-7.62; 5 -12.7,-7.62; 6 -10.16,-7.62; 7 -7.62,-7.62; 8 -5.08,-7.62; 9 -2.54,-7.62; 10 0,-7.62; 11 2.54,-7.62; 12 5.08,-7.62; 13 7.62,-7.62; 14 10.16,-7.62; 15 12.7,-7.62; 16 15.24,-7.62; 17 17.78,-7.62; 18 20.32,-7.62; 19 22.86,-7.62; 20 25.4,-7.62; 21 25.4,7.62; 22 22.86,7.62; 23 20.32,7.62; 24 17.78,7.62; 25 15.24,7.62; 26 12.7,7.62; 27 10.16,7.62; 28 7.62,7.62; 29 5.08,7.62; 30 2.54,7.62; 31 0,7.62; 32 -2.54,7.62; 33 -5.08,7.62; 34 -7.62,7.62; 35 -10.16,7.62; 36 -12.7,7.62; 37 -15.24,7.62; 38 -17.78,7.62; 39 -20.32,7.62; 40 -22.86,7.62
W237-102 = drill 1.194 long: 1 -2.5,-1.27; 2 2.5,-1.27
DB9 = drill 1.016 pad 1.88 square: 1 -5.54,-1.42 | drill 1.016 pad 1.88 round: 2 -2.77,-1.42; 3 0,-1.42; 4 2.77,-1.42; 5 5.54,-1.42; 6 -4.15,1.42; 7 -1.38,1.42; 8 1.38,1.42; 9 4.15,1.42 | drill 3.302 pad 5.08 round: G1 -12.5,0; G2 12.5,0

### Placement (x,y rotation side)
1  139.7,95.25 90 top
100  91.44,96.52 90 top
C1  115.57,46.99 180 top
C2  52.07,109.22 270 top
C3  73.66,105.41 0 top
C4  54.61,88.9 0 top
C5  54.61,76.2 90 top
C6  60.96,105.41 0 top
C7  120.65,68.58 180 top
C8  48.26,53.34 180 top
C9  64.77,109.22 270 top
C10  148.59,95.25 180 top
C11  123.19,46.99 180 top
C12  39.37,109.22 270 top
C13  48.26,105.41 0 top
C14  68.58,53.34 0 top
C15  104.14,109.22 90 top
C16  134.62,48.26 0 top
C17  55.88,53.34 180 top
C18  177.8,30.48 0 top
C19  170.18,30.48 180 top
C20  5.08,100.33 180 top
C21  54.61,81.28 90 top
C22  177.8,114.3 0 top
C23  125.73,43.18 270 top
C24  50.8,81.28 0 top
C25  50.8,88.9 180 top
C26  116.84,68.58 180 top
C27  50.8,74.93 180 top
C28  119.38,46.99 180 top
C29  52.07,53.34 180 top
C30  123.19,104.14 0 top
C31  165.1,15.24 0 top
C32  130.81,114.3 0 top
C33  168.91,104.14 0 top
C34  148.59,107.95 90 top
C35  146.05,111.76 90 top
C36  93.98,110.49 90 top
C37  114.3,76.2 90 top
C38  59.69,50.8 270 top
C39  140.97,111.76 90 top
C41  99.06,110.49 90 top
C42  99.06,96.52 180 top
C45  48.26,15.24 90 top
C46  88.9,15.24 90 top
C47  157.48,15.24 180 top
C48  139.7,15.24 0 top
C49  132.08,15.24 180 top
C50  152.4,30.48 0 top
C51  144.78,30.48 180 top
C52  177.8,15.24 0 top
C53  170.18,15.24 180 top
C54  152.4,15.24 0 top
C55  144.78,15.24 180 top
C56  165.1,30.48 0 top
C57  157.48,30.48 180 top
C58  139.7,30.48 0 top
C59  132.08,30.48 180 top
C60  5.08,81.28 90 top
C61  10.16,100.33 180 top
C62  10.16,81.28 180 top
C63  19.05,39.37 270 top
C64  26.67,109.22 270 top
C65  2.54,29.21 90 top
C66  35.56,105.41 0 top
C67  125.73,72.39 0 top
C68  121.92,72.39 90 top
C69  114.3,72.39 270 top
D1  97.79,104.14 180 top
D2  146.05,102.87 180 top
D3  146.05,100.33 0 top
D4  97.79,101.6 0 top
D5  53.34,19.05 90 top
D6  93.98,20.32 90 top
IC1  57.15,113.03 0 top
IC2  69.85,113.03 0 top
IC3  44.45,113.03 0 top
IC5  161.29,7.62 180 top
IC6  173.99,7.62 180 top
IC7  148.59,7.62 180 top
IC8  135.89,7.62 180 top
IC9  173.99,22.86 180 top
IC10  148.59,22.86 180 top
IC11  161.29,22.86 180 top
IC12  135.89,22.86 180 top
IC13  29.21,33.02 270 top
IC14  31.75,113.03 0 top
IC15  19.05,50.8 90 top
IC16  29.21,40.64 270 top
J1  25.4,62.23 90 top
J2  92.71,55.88 90 top
J3  10.16,60.96 270 top
JP1  125.73,118.11 180 top
JP2  99.06,118.11 0 top
JP3  171.45,118.11 180 top
JP4  144.78,118.11 0 top
L1  50.8,85.09 90 top
L2  118.11,72.39 180 top
LED1  43.18,100.33 0 top
LED2  55.88,101.6 0 top
LED3  68.58,101.6 0 top
LED4  102.87,15.24 270 top
LED5  58.42,15.24 270 top
LED6  63.5,15.24 270 top
LED8  30.48,100.33 0 top
LED9  97.79,15.24 270 top
Q1  63.5,53.34 180 top
Q2  129.54,46.99 180 top
Q3  34.29,15.24 90 top
Q4  74.93,15.24 90 top
R1  48.26,49.53 270 top
R2  115.57,43.18 270 top
R3  7.62,29.21 270 top
R4  68.58,105.41 180 top
R5  43.18,105.41 0 top
R6  172.72,93.98 90 top
R7  170.18,93.98 90 top
R8  167.64,93.98 90 top
R9  127,93.98 90 top
R10  124.46,93.98 90 top
R11  121.92,93.98 90 top
R12  170.18,114.3 180 top
R14  170.18,109.22 90 top
R15  172.72,109.22 90 top
R16  170.18,99.06 180 top
R17  124.46,114.3 180 top
R18  127,109.22 90 top
R19  124.46,109.22 90 top
R20  121.92,109.22 90 top
R21  124.46,99.06 180 top
R23  167.64,109.22 90 top
R24  31.75,21.59 90 top
R25  40.64,21.59 90 top
R26  50.8,21.59 270 top
R27  45.72,21.59 90 top
R28  36.83,21.59 90 top
R29  72.39,21.59 90 top
R30  81.28,21.59 90 top
R31  91.44,21.59 270 top
R32  86.36,21.59 90 top
R33  77.47,21.59 90 top
R34  97.79,21.59 90 top
R35  102.87,21.59 90 top
R36  62.23,21.59 90 top
R38  55.88,105.41 180 top
R39  12.7,29.21 270 top
R40  22.86,36.83 270 top
R41  20.32,44.45 0 top
R42  7.62,50.8 90 top
R43  30.48,105.41 0 top
R44  58.42,21.59 270 top
S1  22.86,78.74 270 top
S2  90.17,71.12 270 top
S4  6.35,91.44 0 top
S5  11.43,91.44 0 top
SV1  38.1,85.09 180 top
SV2  76.2,50.8 180 top
SV3  72.39,85.09 0 top
SV9  38.1,88.9 180 top
SV10  72.39,88.9 180 top
SV11  87.63,46.99 90 top
SV13  148.59,39.37 0 top
SV14  148.59,43.18 0 top
SV15  46.99,27.94 180 top
SV16  87.63,27.94 180 top
T1  43.18,15.24 90 top
T2  83.82,15.24 90 top
U1  113.03,105.41 90 top
U2  158.75,105.41 90 top
U3  16.51,46.99 90 top
U$1  54.61,64.77 0 top
U$2  121.92,58.42 0 top
X1  8.89,107.95 270 top
X2  8.89,73.66 270 top
X3  86.36,8.89 180 top
X4  45.72,8.89 180 top

### Tracks (layer width: path | path; a pad name or v marks a point on that pad's centre or on a via)
3.3V  (via drill 0.6)
  Top 0.254: U3.4 11.99,41.35 12.7,40.64 18.82,40.64 C63.1 21.36,40.87 v21.59,40.64 21.59,39.5 R40.1
  Top 0.356: v19.05,50.8 IC15.2
  Bottom 0.254: v19.05,50.8 20.32,49.53 20.32,46.99 21.59,45.72 v21.59,40.64
5V  (via drill 0.6)
  Top 0.254: 53.34,88.9 C4.1 | IC15.3 22.86,53.82 J1.2
  Top 0.356: 48.26,52.07 R1.1 | 48.26,52.07 48.96,52.77 C8.1 52.07,56.45 52.07,57.15 | 48.26,52.07 49.53,52.07 v50.8,50.8 | v58.42,46.99 58.42,40.64 57.15,39.37 48.26,39.37 46.99,40.64 v46.99,44.45
  Top 0.406: 59.43,105.44 57.31,105.44 R38.1 | v39.37,53.34 41.91,53.34 43.18,52.07 43.18,45.72 44.45,44.45 v46.99,44.45
  Top 0.508: U$1.32 52.07,74.36 C27.1 51.5,76.9 v52.07,77.47 | v54.61,99.06 55.88,100.33 55.88,102.87 57.15,104.14 57.15,105.28 R38.1 | v54.61,91.44 53.34,90.17 53.34,88.9 52.07,88.9 | L1.2 50.8,87.63 52.07,88.9 | 52.07,88.9 C25.1
  Top 0.889: IC1.2 59.43,105.44 C6.1
  Bottom 0.356: J1.2 24.13,60.96 26.67,60.96 29.21,63.5 53.34,63.5 54.61,62.23 U$1.10 | v50.8,50.8 52.07,50.8 54.61,48.26 57.15,48.26 v58.42,46.99
  Bottom 0.406: Q3.3 31.75,13.97 30.48,15.24 30.48,25.4 31.75,26.67 36.83,26.67 38.1,27.94 38.1,30.48 | 38.1,30.48 38.1,52.07 v39.37,53.34 | v46.99,44.45 46.99,53.34 45.72,54.61 45.72,60.96 46.99,62.23 52.07,62.23 53.34,63.5 52.07,64.77 52.07,66.04 49.53,68.58 29.21,68.58 27.94,69.85 27.94,93.98 29.21,95.25 34.29,95.25 35.56,96.52 52.07,96.52 53.34,97.79 | R25.2 40.64,27.94 38.1,30.48
  Bottom 0.508: v52.07,77.47 52.07,92.71 53.34,93.98 53.34,97.79 v54.61,99.06 v54.61,91.44
5V2  (via drill 0.6)  (2 unrouted)
  Top 0.406: U$2.10 121.92,49.53 120.08,48.26 C28.1 120.08,46.42 119.38,45.72 119.38,40.64 118.11,39.37 | v124.46,39.37 118.11,39.37 | 118.11,39.37 116.84,39.37 115.57,40.64 R2.2 | Q4.3 76.2,15.24 76.2,17.78 v74.93,19.05
  Top 0.508: v77.47,96.52 76.2,97.79 73.66,97.79 72.39,99.06 72.39,104.14 72.16,104.37 C3.1 | U$2.32 117.54,67.88 C26.1 117.54,69.15 116.84,69.85 96.52,69.85 v95.25,71.12 110.49,71.12 111.76,72.39 111.76,73.66 113.03,74.93 114.3,74.93 | 116.84,73.66 114.87,73.66 C69.1 114.3,74.93 | 114.3,74.93 C37.1
  Top 0.889: C3.1 72.16,108.2 IC2.2
  Bottom 0.356: U$2.10 121.92,55.88 120.65,57.15 v119.38,57.15 96.52,57.15 93.98,54.61 91.44,54.61 J2.2
  Bottom 0.406: Q4.3 71.12,13.97 69.85,12.7 69.85,5.08 71.12,3.81 101.6,3.81 104.14,1.27 124.46,1.27 125.73,2.54 125.73,38.1 v124.46,39.37 | v74.93,19.05 74.93,21.59 76.2,22.86 78.74,22.86 80.01,24.13 R30.2
  Bottom 0.508: v119.38,57.15 114.3,62.23 96.52,62.23 95.25,63.5 v95.25,71.12 93.98,72.39 87.63,72.39
  Bottom 0.635: v77.47,96.52 77.47,93.98 78.74,92.71 82.55,92.71 83.82,91.44 83.82,87.63 85.09,86.36 85.09,73.66 86.36,72.39 87.63,72.39
5V3  (1 unrouted)
  Top 0.406: C13.1 R5.2
  Top 0.508: SV10.1 SV10.3 SV10.5 SV10.7 SV10.9 SV10.11 SV10.13 60.96,87.63 59.69,88.9 59.69,93.98 58.42,95.25 48.26,95.25 46.99,96.52 46.99,105.18 C13.1 | SV2.2 77.47,53.34 78.74,54.61 82.55,54.61 83.82,55.88 83.82,86.36 82.55,87.63
  Top 0.889: IC3.2 46.73,105.44 C13.1
5VS
  Top 0.406: C66.1 R43.2
  Top 0.508: SV9.1 SV9.3 SV9.5 SV9.7 SV9.9 SV9.11 SV9.13 SV9.15 26.67,87.63 25.4,88.9 25.4,95.25 26.67,96.52 33.02,96.52 34.06,97.56 C66.1
  Top 0.889: IC14.2 34.03,105.44 C66.1
GND  (via drill 0.6)
  Top 0.406: X3.5 80.82,12.24 81.28,12.7 82.55,12.7 T2.3 | T2.3 88.52,13.97 C46.+ | X4.5 40.18,12.24 40.64,12.7 41.91,12.7 T1.3 47.88,13.97 C45.+ | T2.3 v80.01,13.97 | v76.2,20.32 77.47,21.59 R33.2
  Top 1.27: SV9.2 SV9.4 SV9.6 SV9.8
  Bottom 0.406: v80.01,13.97 76.2,17.78 v76.2,20.32
  pour Top: 0,127 184.15,127 184.15,0 0,0
  pour Bottom: 0,127 184.15,127 184.15,-1.27 0,-1.27
MISO  (via drill 0.6)  (1 unrouted)
  Top 0.254: U3.7 6.55,44.65 7.62,45.72 R42.1 7.75,49.53 10.16,49.53 12.7,52.07 12.7,57.15 v13.97,58.42 | v25.4,58.42 J1.1
  Top 0.356: U$1.7 48.26,58.42 v48.26,59.69 48.26,63.5 46.99,64.77 27.94,64.77 J1.1 | v52.07,59.69 57.15,59.69
  Bottom 0.254: v13.97,58.42 16.51,58.42 17.78,57.15 24.13,57.15 v25.4,58.42
  Bottom 0.356: SV11.8 85.09,52.07 85.09,58.42 83.82,59.69 57.15,59.69 | v48.26,59.69 v52.07,59.69
MISO2
  Top 0.254: SV11.7 91.44,50.8 92.71,52.07 J2.1
  Top 0.356: U$2.7 115.57,52.07 115.57,57.15 114.3,58.42 95.25,58.42 J2.1
MOSI  (via drill 0.6)
  Top 0.254: IC13.3 33.25,30.71 34.29,31.75 34.29,53.34 35.56,54.61 43.18,54.61 44.45,55.88 U$1.6
  Top 0.356: v53.34,45.72 45.72,45.72 44.45,46.99 U$1.6
  Bottom 0.356: J1.4 21.59,63.5 21.59,60.96 22.86,59.69 26.67,59.69 29.21,62.23 43.18,62.23 44.45,60.96 U$1.6 | SV11.6 83.82,45.72 v53.34,45.72
MOSI2  (via drill 0.6)
  Top 0.356: SV11.5 87.63,49.53 v87.63,54.61
  Bottom 0.356: J2.4 88.9,58.42 87.63,57.15 v87.63,54.61 88.9,53.34 95.25,53.34 97.79,55.88 111.76,55.88 113.03,54.61 113.03,52.07 U$2.6
N$1
  Top 0.406: LED1.A 41.91,105.28 R5.1
N$2
  Top 0.406: LED2.A 54.61,105.28 R38.2
N$3
  Top 0.406: LED3.A 67.31,105.28 R4.2
N$4
  Top 0.254: 50.1,80.71 C24.1
  Top 0.508: U$1.30 58.42,73.66 58.42,78.74 57.15,80.01 55.18,80.01 C21.1 54.04,80.01 50.8,80.01 50.1,80.71 | C24.1 50.1,82.99 L1.1
N$5
  Top 0.508: U$1.31 C5.1
N$6
  Bottom 1.143: U1.4 118.11,101.6 119.38,102.87 119.38,106.68 121.92,109.22 127,109.22 129.54,111.76 132.08,111.76 133.35,113.03 133.35,116.84
  Bottom 1.27: JP1.1 132.08,118.11 133.35,116.84
N$7
  Top 0.356: SV1.1 48.26,83.82 48.26,73.66 U$1.33
N$8
  Top 0.356: SV1.2 45.72,83.82 45.72,73.66 U$1.34
N$9
  Top 0.356: U$1.35 43.18,73.66 43.18,83.82 SV1.3
N$10
  Top 0.356: SV1.4 40.64,83.82 40.64,73.66 U$1.36
N$11
  Top 0.356: U$1.37 38.1,73.66 38.1,83.82 SV1.5
N$12
  Top 0.356: SV1.6 35.56,83.82 35.56,73.66 U$1.38
N$13
  Top 0.356: U$1.39 33.02,73.66 33.02,83.82 SV1.7
N$14
  Top 0.356: U$1.40 30.48,73.66 30.48,83.82 SV1.8
N$15
  Bottom 0.356: U$1.29 59.69,83.82 60.96,85.09 SV3.1
N$16
  Bottom 0.356: U$1.28 63.5,73.66 63.5,81.28 66.04,83.82 SV3.2
N$17
  Bottom 0.356: SV3.3 68.58,83.82 66.04,81.28 66.04,73.66 U$1.27
N$18
  Bottom 0.356: U$1.26 68.58,73.66 68.58,81.28 71.12,83.82 SV3.4
N$19
  Bottom 0.356: SV3.5 73.66,83.82 71.12,81.28 71.12,73.66 U$1.25
N$20
  Bottom 0.356: U$1.24 73.66,73.66 73.66,81.28 76.2,83.82 SV3.6
N$21
  Bottom 0.356: SV3.7 78.74,83.82 76.2,81.28 76.2,73.66 U$1.23
N$22
  Bottom 0.356: U$1.22 78.74,73.66 78.74,81.28 81.28,83.82 SV3.8
N$23
  Bottom 1.27: JP1.2 121.92,118.11 119.38,115.57 119.38,110.49 118.11,109.22 U1.7
N$24
  Bottom 1.143: JP2.1 96.52,116.84 96.52,100.33
  Bottom 1.27: U1.18 97.79,99.06 96.52,100.33
N$25
  Bottom 1.27: JP2.2 100.33,113.03 101.6,111.76 U1.13
N$26
  Bottom 1.143: JP3.1 173.99,118.11 175.26,116.84 175.26,111.76 172.72,109.22 167.64,109.22 165.1,106.68 165.1,102.87 163.83,101.6 U2.4
N$27
  Bottom 1.143: JP3.2 167.64,118.11 165.1,115.57 165.1,110.49 163.83,109.22 U2.7
N$28
  Bottom 1.422: JP4.1 143.51,107.95 144.78,105.41 144.78,100.33 147.32,97.79 152.4,97.79 153.67,99.06 U2.18
N$29
  Bottom 1.143: 148.59,113.03 152.4,113.03 153.67,111.76 U2.13
  Bottom 1.422: JP4.2 146.05,115.57 148.59,113.03
N$30
  Top 0.356: C15.+ 104.14,113.03 105.41,114.3 U1.12
  Top 0.406: D1.C 101.6,105.79 C15.+
N$31  (1 unrouted)
  Top 0.356: D2.C 149.86,105.41 148.59,106.68 | U2.12 152.4,114.3 151.13,113.03 151.13,109.22 149.86,107.95 C34.+
N$32  (1 unrouted)
  Top 0.356: R16.2 U2.3 163.83,97.79 166.37,97.79 R8.2 R6.2
N$33
  Top 0.356: Q1.1 C14.1
  Bottom 0.356: U$1.13 62.23,55.88 Q1.1
N$34
  Top 0.356: C38.1 60.96,53.34 Q1.2
  Bottom 0.356: Q1.2 59.69,55.88 U$1.12
N$35
  Top 0.356: C16.1 132.08,46.99 Q2.1 129.54,48.26 U$2.13
N$36
  Top 0.356: U$2.12 127,48.26 Q2.2 127,46.99 125.73,45.72 C23.1
N$37
  Top 0.406: C42.+ U1.19
N$42  (2 unrouted)
  Top 0.406: R11.2 120.65,96.52 119.38,97.79 118.11,97.79 U1.3 R21.2
N$43
  Top 0.356: C10.+ 151.13,96.52 U2.19
N$44
  Top 0.356: R15.2 R14.2 R23.2 U2.8 165.1,114.3 R12.2
N$45
  Top 0.406: C42.- 97.79,96.52 96.52,95.25 93.98,95.25 92.71,93.98 100.1
N$46
  Top 0.406: R18.2 R19.2 R20.2 U1.8 119.38,114.3 R17.2
N$47
  Top 0.356: 1.1 142.24,92.71 143.51,93.98 146.05,93.98 C10.-
N$48
  Top 0.356: D3.C D2.A 142.24,99.06 140.97,97.79 1.2
N$49
  Top 0.406: 100.2 92.71,99.06 93.98,100.33 D4.C D1.A
N$50
  Top 0.406: X3.2 89.13,10.39 91.44,12.7 R31.2
  Bottom 0.406: Q4.1 76.2,16.51 77.47,15.24 77.47,10.16 78.74,8.89 87.71,8.89 X3.2
N$51
  Top 0.406: Q4.2 73.03,18.41 R29.1
N$52
  Top 0.406: R26.2 50.8,12.62 X4.2
  Bottom 0.406: Q3.1 35.56,16.51 36.83,15.24 36.83,10.16 38.1,8.89 46.99,8.89 48.26,10.16 48.34,10.16 X4.2
N$53
  Top 0.406: R24.1 31.75,15.88 Q3.2
N$54
  Top 0.406: T1.1 43.18,17.78 41.91,19.05 R25.1 39.37,19.05 38.1,20.32 38.1,26.67 39.37,27.94 45.72,27.94 SV15.3 48.26,30.48 60.96,30.48 62.23,29.21 R36.2
N$55
  Top 0.406: T1.2 39.37,15.24 36.83,17.78 R28.1
  Bottom 0.406: R27.1 43.18,19.05 41.91,17.78 41.91,15.88 T1.2
N$56
  Top 0.406: R27.2 49.53,24.13 54.61,19.05 54.61,15.24 D5.C
  Bottom 0.406: X4.3 45.87,10.31 48.26,12.7 52.07,12.7 D5.C
N$57
  Bottom 0.406: D5.A R26.1 49.53,24.13 48.26,22.86 C45.-
N$58
  Top 0.406: T2.1 83.82,17.78 82.55,19.05 R30.1 80.01,19.05 78.74,20.32 78.74,26.67 80.01,27.94 86.36,27.94 SV16.3 88.9,30.48 96.52,30.48 97.79,29.21 R34.2
N$59
  Top 0.406: R33.1 77.47,17.78 80.01,15.24 T2.2
  Bottom 0.406: T2.2 81.92,17.14 83.82,19.05 R32.1
N$60
  Bottom 0.406: R32.2 87.63,22.86 87.63,17.78 86.36,16.51 X3.3 88.75,12.7 92.71,12.7 93.98,13.97 D6.C
N$61
  Top 0.406: C46.- 89.79,16.13 90.17,16.51 90.17,22.86 R31.1 92.71,25.4 D6.A
N$62
  Bottom 0.406: R29.2 73.66,25.4 86.36,25.4 SV16.4 88.9,27.94 101.6,27.94 102.87,26.67 R35.2
N$63
  Top 0.406: LED9.A R34.1
N$64
  Top 0.406: LED4.A R35.1
N$65  (1 unrouted)
N$66  (1 unrouted)
N$67
  Top 0.406: C11.1 124.69,50.57 U$2.11
N$68
  Top 0.254: U$1.11 57.15,53.57 C17.1
N$69
  Top 0.406: LED8.A 29.21,105.28 R43.1
N$71
  Top 0.508: L2.1 119.51,72.26 120.65,71.12 121.35,71.12 C68.1 124.33,71.69 C67.1 124.46,72.39 125.73,71.12 125.73,67.31 U$2.30
N$72
  Top 0.508: U$2.31 122.15,66.27 C7.1
N$73  (via drill 0.6)
  other vias: 52.07,59.69
N$74  (via drill 0.6)
  Top 0.406: R44.1 58.42,26.67 57.15,27.94 48.26,27.94 SV15.4 45.72,25.4 v41.91,25.4
  Bottom 0.406: v41.91,25.4 33.02,25.4 R24.2
N$75  (via drill 0.6)
  other vias: 57.15,59.69
OC1A  (via drill 0.6)
  Top 0.406: U2.20 154.94,85.09 153.67,83.82 v147.32,83.82 | U$2.19 v144.78,58.42
  Bottom 0.406: v147.32,83.82 147.32,82.55 146.05,81.28 146.05,71.12 147.32,69.85 148.59,69.85 151.13,67.31 151.13,62.23 148.59,59.69 146.05,59.69 v144.78,58.42
OC1B  (via drill 0.6)
  Top 0.356: U$2.18 142.24,59.69 v143.51,60.96 | U2.11 156.21,116.84 157.48,115.57 v157.48,88.9
  Top 0.406: v146.05,83.82 146.05,86.36 147.32,87.63 v148.59,87.63
  Bottom 0.356: v157.48,88.9 156.21,87.63 v148.59,87.63
  Bottom 0.406: v143.51,60.96 148.59,60.96 149.86,62.23 149.86,67.31 148.59,68.58 147.32,68.58 144.78,71.12 144.78,82.55 v146.05,83.82
OC2A  (via drill 0.6)
  Top 0.356: v113.03,83.82 114.3,85.09 121.92,85.09 123.19,83.82 125.73,83.82 132.08,77.47 132.08,72.39 133.35,71.12 143.51,71.12 144.78,69.85 144.78,68.58 U$2.21
  Bottom 0.356: v113.03,83.82 110.49,83.82 109.22,85.09 U1.20
OC2B  (via drill 0.6)
  Top 0.356: U1.11 110.49,116.84 111.76,115.57 111.76,91.44 v115.57,87.63 | v123.19,74.93 v115.57,83.82 | v147.32,62.23 U$2.20
  Bottom 0.356: v123.19,74.93 123.19,64.77 125.73,62.23 v147.32,62.23 | v115.57,83.82 v115.57,87.63
PC0_2  (via drill 0.6)
  Top 0.356: v156.21,85.09 157.48,85.09 160.02,87.63 v160.02,88.9 v160.02,95.25
  Bottom 0.356: U2.10 161.29,116.84 160.02,115.57 v160.02,95.25 v160.02,88.9
  Bottom 0.406: v156.21,85.09 144.78,85.09 143.51,83.82 143.51,67.31 U$2.22
PC1_2  (via drill 0.6)
  Top 0.356: U2.9 160.02,114.3 158.75,113.03 v158.75,87.63
  Bottom 0.356: v158.75,87.63 157.48,86.36 144.78,86.36 142.24,83.82 U$2.23
PC2_2  (via drill 0.6)
  Top 0.406: v140.97,76.2 140.97,80.01 142.24,81.28 156.21,81.28 162.56,87.63 162.56,91.44 165.1,93.98 165.1,95.25 163.83,96.52 U2.2
  Bottom 0.356: U$2.24 140.97,67.31 140.97,72.39
  Bottom 0.406: 140.97,72.39 v140.97,76.2
PC3_2  (via drill 0.6)
  Top 0.406: v139.7,80.01 142.24,82.55 156.21,82.55 161.29,87.63 161.29,92.71 U2.1
  Bottom 0.356: U$2.25 139.7,68.58 v139.7,80.01
PC4_2  (via drill 0.6)
  Top 0.356: U$2.26 130.81,69.85 130.81,77.47 125.73,82.55 121.92,82.55 v120.65,83.82 | v120.65,88.9 118.11,91.44 115.57,91.44 v114.3,92.71
  Bottom 0.356: v114.3,92.71 114.3,115.57 115.57,116.84 U1.10 | v120.65,83.82 v120.65,88.9
PC5_2  (via drill 0.6)
  Top 0.356: U$2.27 129.54,68.58 129.54,77.47 125.73,81.28 121.92,81.28 v119.38,83.82 | v119.38,88.9 118.11,90.17 114.3,90.17 113.03,91.44 113.03,113.03 114.3,114.3 U1.9
  Bottom 0.356: v119.38,83.82 v119.38,88.9
PC6_2  (via drill 0.6)
  Top 0.356: U$2.28 128.27,67.31 128.27,77.47 125.73,80.01 121.92,80.01 v118.11,83.82
  Bottom 0.356: v118.11,83.82 118.11,91.44 119.38,92.71 119.38,95.25 118.11,96.52 U1.2
PC7_2  (via drill 0.6)
  Top 0.356: U$2.29 v127,69.85 | v116.84,83.82 121.92,78.74 125.73,78.74 127,77.47 v127,74.93
  Bottom 0.356: v116.84,83.82 U1.1 | v127,69.85 v127,74.93
PD0  (via drill 0.6)
  Top 0.406: v69.85,41.91 71.12,43.18 71.12,49.53 SV2.4
  Bottom 0.254: U$1.14 64.77,55.88 66.04,54.61 66.04,52.07 67.31,50.8 SV2.4
  Bottom 0.406: SV15.1 49.53,40.64 50.8,41.91 v69.85,41.91
PD1  (via drill 0.6)
  Top 0.254: U$1.15 67.31,55.88 68.58,54.61 73.66,54.61 74.93,53.34 SV2.3
  Top 0.406: v73.66,41.91 74.93,43.18 SV2.3
  Bottom 0.406: SV15.2 50.8,27.94 50.8,39.37 52.07,40.64 71.12,40.64 72.39,41.91 v73.66,41.91
RESET
  Top 0.356: J1.5 49.53,67.31 50.8,66.04 50.8,58.42 U$1.9 52.77,56.45 52.77,55.31 | R1.2 50.67,48.13 53.34,50.8 53.34,52.77 C29.1 52.77,55.31 | 52.77,55.31 54.61,57.15
  Bottom 0.356: S1.2 25.4,70.13 J1.5
RESET2
  Top 0.254: J2.5 92.71,67.59 S2.2
  Top 0.356: U$2.9 118.11,52.07 118.11,57.15 114.3,60.96 J2.5 | C1.1 115.57,46.29 R2.1
  Top 0.406: C1.1 116.84,46.99 116.84,48.26 U$2.9
SCK
  Top 0.254: IC16.3 26.9,38.33 27.94,39.37 27.94,44.45 26.67,45.72 25.4,45.72 24.13,46.99 24.13,63.5 J1.3
  Top 0.356: U$1.8 49.53,64.77 48.26,66.04 26.67,66.04 J1.3
  Bottom 0.356: SV11.4 85.09,44.45 50.8,44.45 49.53,45.72 U$1.8
SCK2
  Top 0.356: J2.3 93.98,59.69 114.3,59.69 116.84,57.15 U$2.8
  Bottom 0.356: SV11.3 90.17,44.45 106.68,44.45 110.49,48.26 115.57,48.26 116.84,49.53 U$2.8
SDCS
  Top 0.254: U3.2 7.84,39.15 8.89,38.1 8.89,34.29 7.62,33.02 R3.1
SDMOSI
  Top 0.254: 6.35,40.25 9.28,40.25 10.16,39.37 10.16,34.29 11.43,33.02 11.43,31.75 11.56,31.75 R39.1 | 6.35,40.25 U3.3 | IC13.2 12.7,33.02 11.43,34.29 11.43,39.37 10.16,40.64 6.74,40.64 6.35,40.25
SDSCK
  Top 0.254: U3.5 6.35,42.45 | 6.35,42.45 16.92,42.45 R41.1 | IC16.2 24.13,40.64 22.86,41.91 6.89,41.91 6.35,42.45
SENSEA  (via drill 0.6)
  Top 0.356: v129.54,92.71 129.54,88.9 128.27,87.63 118.11,87.63 116.84,86.36 113.03,86.36 111.76,85.09 111.76,74.93 v109.22,72.39
  Top 0.406: C30.+ 122.3,103.76 123.19,102.87 125.73,102.87 127,101.6 R21.1
  Bottom 0.356: R21.1 129.54,99.06 130.81,97.79 130.81,93.98 v129.54,92.71 | v109.22,72.39 109.22,69.85 110.49,68.58 115.57,68.58 116.84,67.31 U$2.33
SENSEA2  (via drill 0.6)
  Top 0.356: C33.+ 168.91,102.87 171.45,102.87 172.72,101.6 R16.1 | v134.62,60.96 138.43,60.96 140.97,63.5 151.13,63.5 152.4,64.77 152.4,67.31 147.32,72.39 147.32,78.74 148.59,80.01 156.21,80.01 163.83,87.63 163.83,90.17 166.37,92.71 173.99,92.71 v175.26,93.98
  Bottom 0.356: U$2.35 115.57,62.23 121.92,62.23 124.46,59.69 133.35,59.69 v134.62,60.96 | v175.26,93.98 175.26,97.79 173.99,99.06 R16.1
SENSEB  (via drill 0.6)
  Top 0.356: U$2.34 114.3,64.77 115.57,63.5 121.92,63.5 124.46,60.96 132.08,60.96 133.35,62.23 v133.35,64.77 | v125.73,93.98 128.27,93.98 129.54,95.25 129.54,106.68 128.27,107.95 128.27,113.03 R17.1 | v133.35,77.47 v125.73,85.09
  Top 0.406: R17.1 C32.+
  Bottom 0.356: v133.35,64.77 v133.35,77.47 | v125.73,85.09 123.19,85.09 121.92,86.36 121.92,88.9 120.65,90.17 120.65,92.71 121.92,93.98 v125.73,93.98
SENSEB2  (via drill 0.6)
  Top 0.356: C22.+ R12.1 173.99,113.03 v173.99,95.25
  Bottom 0.356: U$2.36 109.22,68.58 107.95,69.85 107.95,72.39 110.49,74.93 110.49,81.28 111.76,82.55 125.73,82.55 132.08,88.9 144.78,88.9 146.05,90.17 162.56,90.17 166.37,93.98 172.72,93.98 v173.99,95.25
SERVO1  (via drill 0.6)
  Top 0.356: U$2.4 104.14,48.26 104.14,39.37 105.41,38.1 110.49,38.1 v111.76,39.37
  Bottom 0.356: v111.76,39.37 115.57,39.37 116.84,40.64 116.84,43.18 118.11,44.45 138.43,44.45 SV14.1
SERVO2
  Top 0.356: U$2.3 104.14,49.53 102.87,48.26 102.87,38.1 104.14,36.83 127,36.83 128.27,35.56 130.81,35.56 132.08,36.83 132.08,43.18 135.89,46.99 139.7,46.99 142.24,44.45 SV14.2
SERVO3  (via drill 0.6)
  Top 0.356: U$2.2 101.6,38.1 104.14,35.56 107.95,35.56 v109.22,34.29 | v134.62,43.18 v137.16,45.72
  Bottom 0.356: v109.22,34.29 119.38,34.29 120.65,35.56 120.65,41.91 121.92,43.18 v134.62,43.18 | v137.16,45.72 143.51,45.72 144.78,44.45 SV14.3
SERVO4  (via drill 0.6)
  Top 0.356: v110.49,54.61 v114.3,54.61 | v120.65,53.34 123.19,53.34 v124.46,54.61 | v153.67,50.8 152.4,49.53 149.86,49.53 148.59,48.26 v147.32,48.26 | v147.32,45.72 SV14.4
  Bottom 0.356: U$2.1 99.06,52.07 100.33,53.34 109.22,53.34 v110.49,54.61 | v114.3,54.61 119.38,54.61 v120.65,53.34 | v124.46,54.61 128.27,54.61 129.54,53.34 130.81,53.34 133.35,55.88 148.59,55.88 v153.67,50.8 | v147.32,48.26 v147.32,45.72
SERVO5  (via drill 0.6)
  Top 0.356: U$2.17 139.7,55.88 v138.43,57.15 | v156.21,52.07 156.21,49.53 154.94,48.26 v149.86,48.26
  Bottom 0.356: v138.43,57.15 148.59,57.15 153.67,52.07 v156.21,52.07 | v149.86,48.26 SV14.5
SERVO6
  Top 0.356: U$2.16 140.97,46.99 151.13,46.99 152.4,45.72 SV14.6
SERVO7  (via drill 0.6)
  Top 0.406: SV16.2 v92.71,29.21
  Bottom 0.356: U$2.15 134.62,52.07 135.89,53.34 148.59,53.34 149.86,52.07 149.86,49.53 153.67,45.72 153.67,44.45 SV14.7
  Bottom 0.406: v92.71,29.21 92.71,39.37 93.98,40.64 107.95,40.64 113.03,45.72 133.35,45.72 134.62,46.99 U$2.15
SERVO8
  Bottom 0.356: SV14.8 151.13,49.53 151.13,52.07 148.59,54.61 134.62,54.61 132.08,52.07 U$2.14
  Bottom 0.406: SV16.1 90.17,31.75 91.44,33.02 91.44,40.64 92.71,41.91 107.95,41.91 110.49,44.45 110.49,45.72 111.76,46.99 124.46,46.99 125.73,48.26 130.81,48.26 132.08,49.53 U$2.14
SS
  Bottom 0.356: SV11.2 43.18,43.18 41.91,44.45 U$1.5
SS2  (via drill 0.6)
  Top 0.356: v87.63,46.99 90.17,46.99 91.44,48.26 91.44,49.53 93.98,52.07 95.25,52.07 97.79,54.61 109.22,54.61 110.49,53.34 110.49,52.07 U$2.5
  Bottom 0.356: SV11.1 87.63,44.45 v87.63,46.99
SVPWR1
  Top 0.508: IC9.2 171.68,27.69 C19.1 171.68,39.14 170.18,40.64 SV13.15
SVPWR2  (via drill 0.6)
  Top 0.508: IC5.2 158.98,12.45 C47.1 v161.29,15.24
  Bottom 0.508: SV13.11 153.67,39.37 153.67,35.56 154.94,34.29 160.02,34.29 161.29,33.02 v161.29,15.24
SVPWR3  (via drill 0.6)
  Top 0.508: IC8.2 133.58,12.45 C49.1 v135.89,15.24
  Bottom 0.508: SV13.7 146.05,39.37 146.05,19.05 144.78,19.05 143.51,17.78 137.16,17.78 135.89,16.51 v135.89,15.24
SVPWR4
  Top 0.508: IC10.2 146.28,27.69 C51.1 146.28,31.52 144.78,33.02 135.89,33.02 134.62,34.29 134.62,38.1 135.89,39.37 140.97,39.37 SV13.3
SVPWR5  (via drill 0.6)
  Top 0.508: IC6.2 171.68,12.45 C53.1 v173.99,15.24 | SV13.13 156.21,39.37 v167.64,39.37
  Bottom 0.508: v167.64,39.37 172.72,39.37 173.99,38.1 v173.99,15.24
SVPWR6  (via drill 0.6)
  Top 0.508: IC7.2 146.28,12.45 C55.1 v148.59,15.24
  Bottom 0.508: SV13.9 148.59,39.37 v148.59,15.24
SVPWR7
  Top 0.508: IC11.2 158.98,27.69 C57.1 158.75,30.71 158.75,31.75 157.48,33.02 151.13,33.02 149.86,34.29 144.78,34.29 143.51,35.56 143.51,39.37 SV13.5
SVPWR8
  Top 0.508: IC12.2 133.58,27.69 C59.1 133.35,29.21 133.35,39.37 134.62,40.64 SV13.1
VCCIN  (1 unrouted)
  Top 0.889: C64.1 27.71,110.72 | 27.71,110.72 29.21,109.22 29.21,107.97 | 29.21,107.97 29.21,107.95 | 29.21,107.97 IC14.1 | 27.71,110.72 C12.1 | IC3.1 42.17,108.96 40.64,110.49 39.6,110.49 C12.1 | C2.1 39.6,110.72 39.37,110.49 C12.1 | C2.1 C9.1 | C2.1 53.11,110.72 54.61,109.22 54.61,108.49 IC1.1 | IC2.1 67.57,108.96 66.04,110.49
  Top 1.016: S4.2 8.89,88.9 8.89,86.36 10.16,85.09 19.05,85.09 20.32,86.36 20.32,109.22 21.59,110.49 26.44,110.49 C64.1
  Bottom 1.27: C60.+ 3.43,80.39 2.54,81.28 2.54,90.17 3.81,91.44 S4.2
VCCIN2  (4 unrouted)
  Top 0.406: U1.14 108.65,109.79
  Top 0.508: IC12.1 138.2,27.69 C58.1 | IC7.1 150.9,12.45 C54.1 | IC10.1 150.9,27.69 C50.1 | IC9.1 176.3,27.69 C18.1 | IC6.1 176.3,12.45 C52.1 | IC8.1 138.43,12.68 138.43,15.24 C48.1 | IC5.1 163.6,12.45 C31.1 | IC11.1 163.6,27.69 C56.1
  Top 0.762: D3.A 151.13,101.6 153.67,101.6 U2.17
  Top 0.813: D4.A 107.95,101.6 U1.17
  Top 1.143: 144.78,106.68 140.97,106.68 139.7,107.95 139.7,123.19 140.97,124.46 | 144.78,106.68 146.05,106.68 147.32,105.41 147.32,101.6 148.59,100.33 D3.A | U2.14 153.67,109.22 152.4,107.95 152.4,102.87 153.67,101.6 | U1.14 107.95,109.22 106.68,107.95 106.68,102.87 107.95,101.6 | 91.44,124.46 90.17,123.19 | 90.17,123.19 90.17,109.22 91.44,107.95 97.79,107.95 | 97.79,107.95 99.06,106.68 99.06,102.87 100.33,101.6 D4.A | C39.+ C35.+ 146.05,107.95 144.78,106.68 | C36.+ 98.68,109.6 99.06,109.22 97.79,107.95 | 13.97,113.03 13.97,119.38 16.51,121.92 88.9,121.92 90.17,123.19
  Top 1.27: 138.43,12.68 138.43,11.43 139.7,10.16 149.86,10.16 151.13,11.43 151.13,12.16 | 151.13,12.16 IC7.1 | 151.13,12.16 155.48,12.16 157.48,10.16 162.56,10.16 163.83,11.43 | IC5.1 167.92,12.42 170.18,10.16 175.26,10.16 176.53,11.43 | 176.53,11.43 176.53,12.16 IC6.1 | 176.53,11.43 180.34,11.43 181.61,12.7 181.61,26.67 180.62,27.66 IC9.1 176.53,27.4 | IC12.1 138.17,26.93 139.7,25.4 149.86,25.4 151.13,26.67 | 176.53,27.4 176.53,25.4 175.26,24.13 171.45,24.13 168.91,26.67 163.83,26.67 162.56,25.4 157.48,25.4 155.22,27.66 IC10.1 | 176.53,27.4 176.53,41.91 177.8,43.18 180.34,43.18 181.61,44.45 181.61,123.19 180.34,124.46 140.97,124.46 91.44,124.46 | 13.97,113.03 13.97,93.98 S5.2
  Bottom 1.27: C62.+ 11.43,81.28 13.97,83.82 13.97,90.17 12.7,91.44 S5.2
VCCTERM  (1 unrouted)
  Top 1.016: J3.2 8.61,58.7 7.62,59.69 7.62,64.77 2.54,69.85 2.54,92.71 3.81,93.98 S4.1
  Bottom 1.27: S4.1 6.35,99.95 C20.+ 6.35,100.33 6.35,101.6 3.81,104.14 3.81,109.22 5.08,110.49 7.58,110.49 X1.1
VCCTERM2
  Bottom 1.27: X2.1 7.62,86.36 8.89,87.63 8.89,92.71 10.16,93.98 S5.1 11.43,100.33 C61.+

### Text on the board
tValues: High Voltage Power Rail 12-18v | High Voltage Power Rail 12-18v | Motor Headers | Motor Headers | H-Bridge 0 | H-Bridge 1 | Logic Level Power | Logic Level Voltage Regulators | Analog Inputs | Digital Inputs | High Voltage Power | Main Processor | Co Processor | XBEE / USART | High Voltage Power Rail 12-18v | SPI Jumper Header | Servo Ports | Micro SD Card | Servo Regulators | Main Processor RS232 Serial | Co-Processor RS232 Serial